# EAGLE schematic SAP-1 (EAGLE 9.5.1)
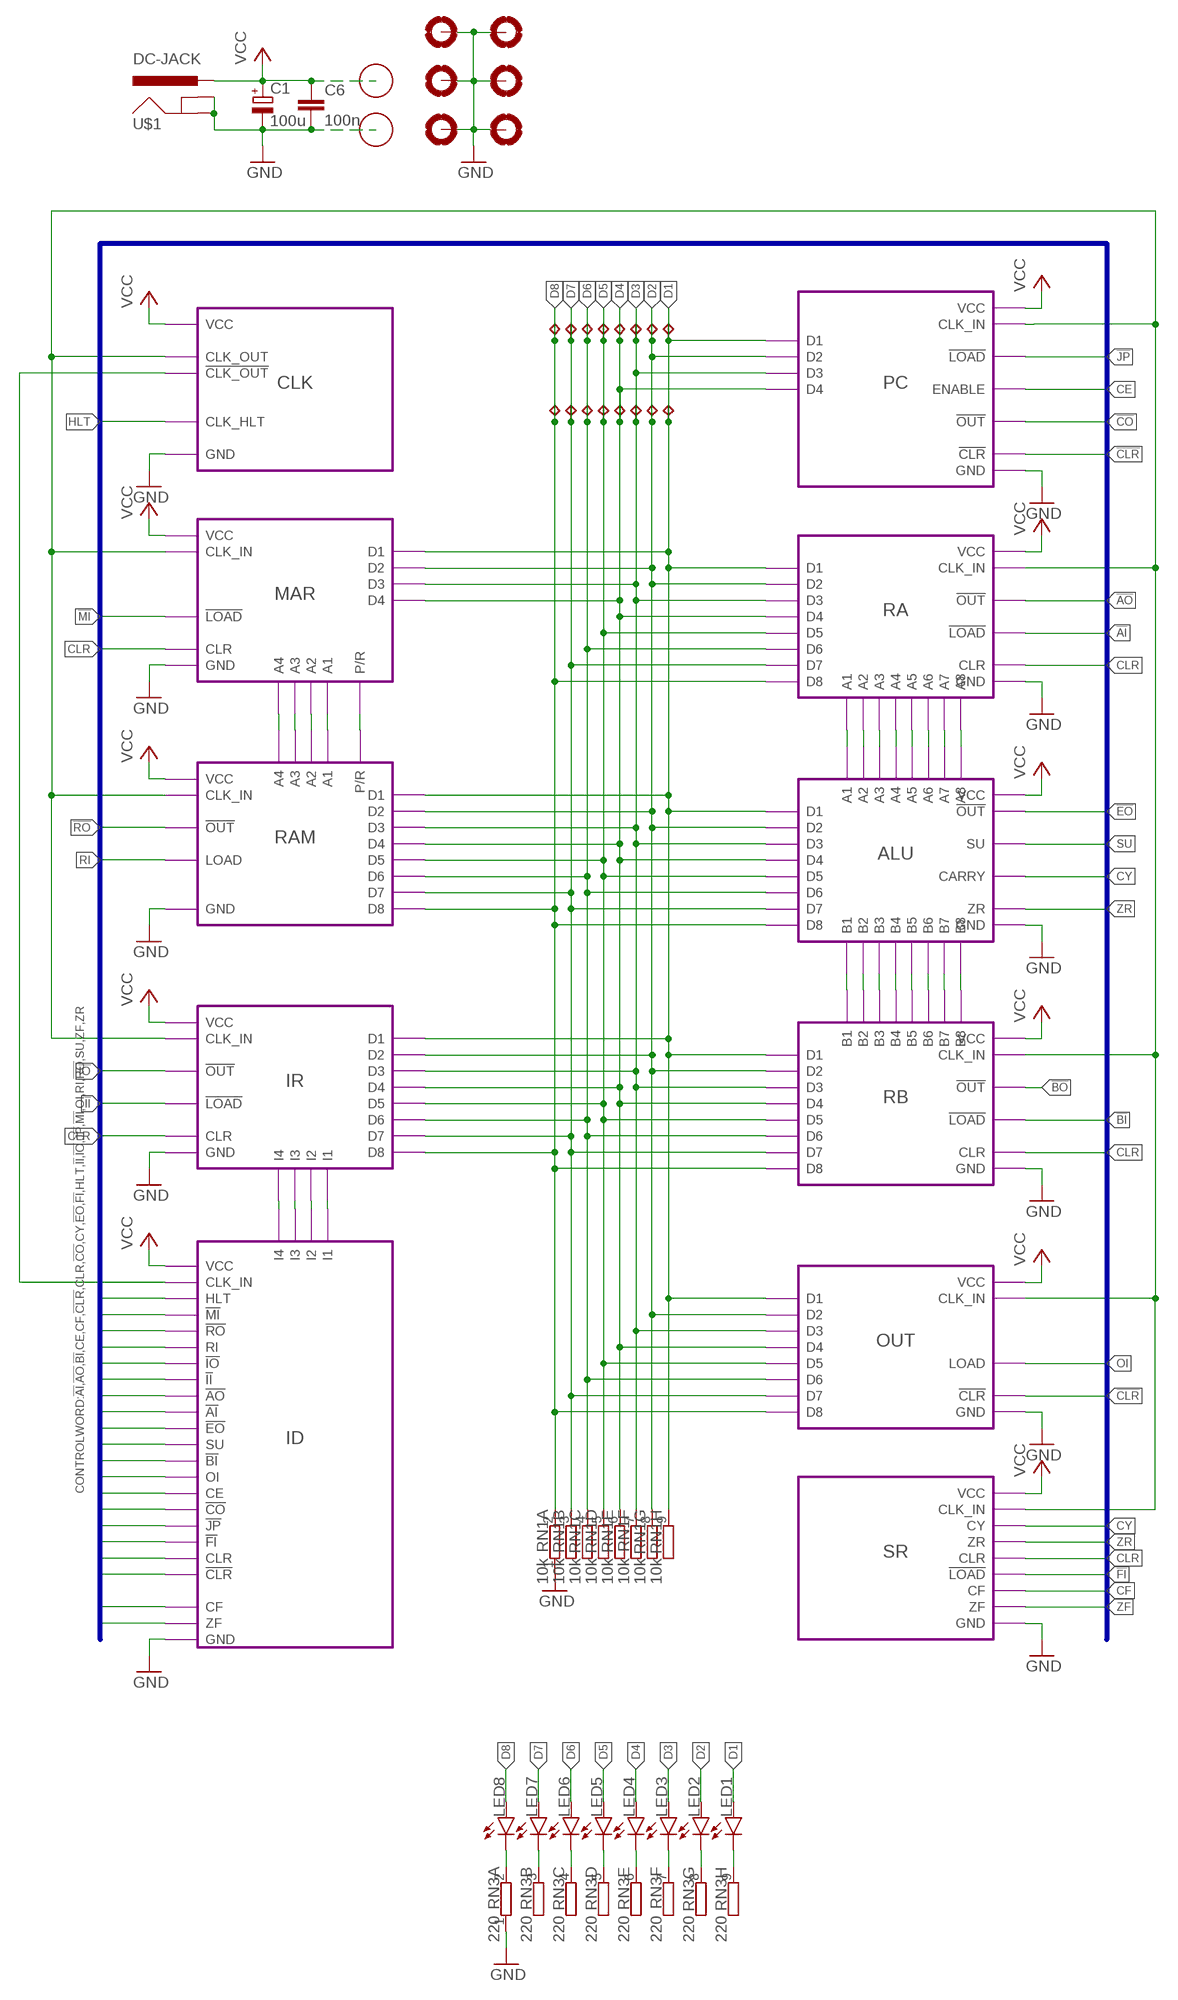
[diagram p0: schematic, sheet 1]

## Parts
C1  100u  CPOL-EUE3.5-8  [E3,5-8]
C6  100n  C-EU050-024X044  [C050-024X044]
H1  MOUNT-PAD-ROUND3.2  [3,2-PAD]
H2  MOUNT-PAD-ROUND3.2  [3,2-PAD]
H3  MOUNT-PAD-ROUND3.2  [3,2-PAD]
H4  MOUNT-PAD-ROUND3.2  [3,2-PAD]
H5  3.2  MOUNT-PAD-ROUND3.2  [3,2-PAD]
H6  3.2  MOUNT-PAD-ROUND3.2  [3,2-PAD]
J1  TERMINAL-1BRIDGE  [VOGT-1098A.68]
J2  TERMINAL-1BRIDGE  [VOGT-1098A.68]
LED1  RED  LED3MM  [LED3MM]
LED2  RED  LED3MM  [LED3MM]
LED3  RED  LED3MM  [LED3MM]
LED4  RED  LED3MM  [LED3MM]
LED5  RED  LED3MM  [LED3MM]
LED6  RED  LED3MM  [LED3MM]
LED7  RED  LED3MM  [LED3MM]
LED8  RED  LED3MM  [LED3MM]
RN1  10k  GE08R  [SIL9]
RN3  220  GE08R  [SIL9]
TP1  TPTP06R  [TP06R]
TP2  TPTP06R  [TP06R]
TP3  TPTP06R  [TP06R]
TP4  TPTP06R  [TP06R]
TP5  TPTP06R  [TP06R]
TP6  TPTP06R  [TP06R]
TP7  TPTP06R  [TP06R]
TP8  TPTP06R  [TP06R]
TP9  TPTP06R  [TP06R]
TP10  TPTP06R  [TP06R]
TP11  TPTP06R  [TP06R]
TP12  TPTP06R  [TP06R]
TP13  TPTP06R  [TP06R]
TP14  TPTP06R  [TP06R]
TP15  TPTP06R  [TP06R]
TP16  TPTP06R  [TP06R]
U$1  DC-JACK  [POWER_JACK_PTH]

## Module instances
CLK = CLOCK
RA = DATA_REGISTER_A
IR = INSTRUCTION_REGISTER
RB = DATA_REGISTER_B
ALU = ALU
MAR = MEMORY_ADDRESS_REGISTER
RAM = RAM
PC = PROGRAM_COUNTER
OUT = OUTPUT_DISPLAY
ID = INSTRUCTION_DECODER
SR = STATUS_REGISTER

## Nets
!AI: port RA.!LOAD ID.!AI
!AO: port RA.!OUT ID.!AO
!BI: port RB.!LOAD ID.!BI
!BO: port RB.!OUT
!CLK: port ID.CLK_IN CLK.!CLK_OUT
!CLR: port ID.!CLR OUT.!CLR PC.!CLR
!CO: port PC.!OUT ID.!CO
!EO: port ALU.!OUT ID.!EO
!FI: port SR.!LOAD ID.!FI
!II: port IR.!LOAD ID.!II
!IO: port IR.!OUT ID.!IO
!JP: port PC.!LOAD ID.!JP
!MI: port MAR.!LOAD ID.!MI
!RO: port RAM.!OUT ID.!RO
CE: port PC.ENABLE ID.CE
CF: port SR.CF ID.CF
CLK: port CLK.CLK_OUT MAR.CLK_IN RAM.CLK_IN IR.CLK_IN PC.CLK_IN RA.CLK_IN RB.CLK_IN OUT.CLK_IN SR.CLK_IN
CLR: port ID.CLR MAR.CLR IR.CLR RB.CLR RA.CLR SR.CLR
CY: port ALU.CARRY SR.CY
D1: LED1.A RN1.9 TP8.TP TP16.TP ; port RA.D1 MAR.D1 RAM.D1 IR.D1 ALU.D1 RB.D1 PC.D1 OUT.D1
D2: LED2.A RN1.8 TP7.TP TP15.TP ; port RA.D2 MAR.D2 RAM.D2 IR.D2 ALU.D2 RB.D2 PC.D2 OUT.D2
D3: LED3.A RN1.7 TP6.TP TP14.TP ; port RA.D3 MAR.D3 RAM.D3 IR.D3 ALU.D3 RB.D3 PC.D3 OUT.D3
D4: LED4.A RN1.6 TP5.TP TP13.TP ; port RA.D4 MAR.D4 RAM.D4 IR.D4 ALU.D4 RB.D4 PC.D4 OUT.D4
D5: LED5.A RN1.5 TP4.TP TP12.TP ; port RA.D5 RAM.D5 ALU.D5 RB.D5 OUT.D5 IR.D5
D6: LED6.A RN1.4 TP3.TP TP11.TP ; port RA.D6 RAM.D6 ALU.D6 RB.D6 OUT.D6 IR.D6
D7: LED7.A RN1.3 TP2.TP TP10.TP ; port RA.D7 RAM.D7 ALU.D7 RB.D7 OUT.D7 IR.D7
D8: LED8.A RN1.2 TP1.TP TP9.TP ; port RA.D8 RAM.D8 ALU.D8 RB.D8 OUT.D8 IR.D8
GND: C1.- C6.2 H1.B3,2(MOUNT) H2.B3,2(MOUNT) H3.B3,2(MOUNT) H4.B3,2(MOUNT) H5.B3,2(MOUNT) H6.B3,2(MOUNT) J2.P$1 J2.P$2 RN1.1 RN3.1 U$1.GND U$1.GNDBREAK ; port PC.GND RA.GND ALU.GND RB.GND OUT.GND SR.GND ID.GND IR.GND RAM.GND MAR.GND CLK.GND
HLT: port CLK.CLK_HLT ID.HLT
N$1: port RA.A8 ALU.A8
N$2: port RA.A7 ALU.A7
N$3: port RA.A6 ALU.A6
N$4: port RA.A5 ALU.A5
N$5: port RA.A4 ALU.A4
N$6: port RA.A3 ALU.A3
N$7: port RA.A2 ALU.A2
N$8: port RA.A1 ALU.A1
N$9: port RB.B1 ALU.B1
N$10: port RB.B2 ALU.B2
N$11: port RB.B3 ALU.B3
N$12: port RB.B4 ALU.B4
N$13: port RB.B5 ALU.B5
N$14: port RB.B6 ALU.B6
N$15: port RB.B7 ALU.B7
N$16: port RB.B8 ALU.B8
N$17: port RAM.A1 MAR.A1
N$18: port MAR.A2 RAM.A2
N$19: port RAM.A3 MAR.A3
N$20: port MAR.A4 RAM.A4
N$21: port RAM.P/R MAR.P/R
N$23: LED8.K(C) RN3.2
N$24: LED7.K(C) RN3.3
N$25: LED6.K(C) RN3.4
N$26: LED5.K(C) RN3.5
N$27: LED4.K(C) RN3.6
N$28: LED3.K(C) RN3.7
N$29: LED2.K(C) RN3.8
N$30: LED1.K(C) RN3.9
N$31: port ID.I1 IR.I1
N$33: port IR.I2 ID.I2
N$34: port ID.I3 IR.I3
N$35: port IR.I4 ID.I4
OI: port OUT.LOAD ID.OI
RI: port RAM.LOAD ID.RI
SU: port ALU.SU ID.SU
VCC: C1.+ C6.1 J1.P$1 J1.P$2 U$1.PWR ; port PC.VCC RA.VCC ALU.VCC RB.VCC OUT.VCC SR.VCC ID.VCC IR.VCC RAM.VCC MAR.VCC CLK.VCC
ZF: port SR.ZF ID.ZF
ZR: port ALU.ZR SR.ZR

## Buses
CONTROLWORD:!AI,!AO,!BI,CE,CF,!CLR,CLR,!CO,CY,!EO,!FI,HLT,!II,!IO,!JP,!MI,OI,RI,!RO,SU,ZF,ZR

## Library data of the parts
C1 = rcl:CPOL-EU: POLARIZED CAPACITOR, European symbol; MOUSER: 710-860040674004; SPICEPREFIX: C
C6 = rcl:C-EU: CAPACITOR, European symbol; MOUSER: 594-K104K15X7RF53H5; SPICEPREFIX: C
H1-H6 = holes:MOUNT-PAD-ROUND: MOUNTING PAD, round
J1 J2 = AdapterBoard:TERMINAL-1
LED1-LED8 = led:LED: LED OSRAM: - CHIPLED LG R971, LG N971, LY N971, LG Q971, LY Q971, LO R971, LY R971 LH N974, LH R974 LS Q976, LO Q976, LY Q976 LO Q996 - Hyper CHIPLED LW Q18S LB Q993, LB Q99A, LB R99A - SideLED LS A670, LO A670, LY A670, LG A670, LP A670 LB A673, LV A673, LT A673, LW A673 LH A674 LY A675 LS A676, LA A676, LO A676, LY A676, LW A676 LS A679, LY A679, LG A679 - Hyper Micro SIDELED® LS Y876, LA Y876, LO Y876, LY Y876 LT Y87S - SmartLED LW L88C, LW L88S LB L89C, LB L89S, LG L890 LS L89K, LO L89K, LY L89K LS L896, LA L896, LO L896, LY L896 - TOPLED LS T670, LO T670, LY T670, LG T670, LP T670 LSG T670, LSP T670, LSY T670, LOP T670, LYG T670 LG T671, LOG T671, LSG T671 LB T673, LV T673, LT T673, LW T673 LH T674 LS T676, LA T676, LO T676, LY T676, LB T676, LH T676, LSB T676, LW T676 LB T67C, LV T67C, LT T67C, LS T67K, LO T67K, LY T67K, LW E67C LS E67B, LA E67B, LO E67B, LY E67B, LB E67C, LV E67C, LT E67C LW T67C LS T679, LY T679, LG T679 LS T770, LO T770, LY T770, LG T770, LP T770 LB T773, LV T773, LT T773, LW T773 LH T774 LS E675, LA E675, LY E675, LS T675 LS T776, LA T776, LO T776, LY T776, LB T776 LHGB T686 LT T68C, LB T68C - Hyper Mini TOPLED® LB M676 - Mini TOPLED Santana® LG M470 LS M47K, LO M47K, LY M47K Source: http://www.osram.convergy.de LUXEON: - LUMILED® LXK2-PW12-R00, LXK2-PW12-S00, LXK2-PW14-U00, LXK2-PW14-V00 LXK2-PM12-R00, LXK2-PM12-S00, LXK2-PM14-U00 LXK2-PE12-Q00, LXK2-PE12-R00, LXK2-PE12-S00, LXK2-PE14-T00, LXK2-PE14-U00 LXK2-PB12-K00, LXK2-PB12-L00, LXK2-PB12-M00, LXK2-PB14-N00, LXK2-PB14-P00, LXK2-PB14-Q00 LXK2-PR12-L00, LXK2-PR12-M00, LXK2-PR14-Q00, LXK2-PR14-R00 LXK2-PD12-Q00, LXK2-PD12-R00, LXK2-PD12-S00 LXK2-PH12-R00, LXK2-PH12-S00 LXK2-PL12-P00, LXK2-PL12-Q00, LXK2-PL12-R00 Source: www.luxeon.com KINGBRIGHT: KA-3528ASYC Source: www.kingbright.com; MOUSER: 743-INL-3AR30
RN1 = resistor-sil:GE08R: SIL RESISTOR; MOUSER: 652-4609X-1LF-10K; OC_FARNELL: unknown; OC_NEWARK: unknown
RN3 = resistor-sil:GE08R: SIL RESISTOR; MOUSER: 652-4609X-1LF-220; OC_FARNELL: unknown; OC_NEWARK: unknown
TP1-TP16 = testpad:TP: Test pad
U$1 = Parts:DC-JACK

## Module CLOCK
Ports: CLK_OUT(out) CLK_HLT(in) !CLK_OUT(out) VCC(pwr) GND(pwr)
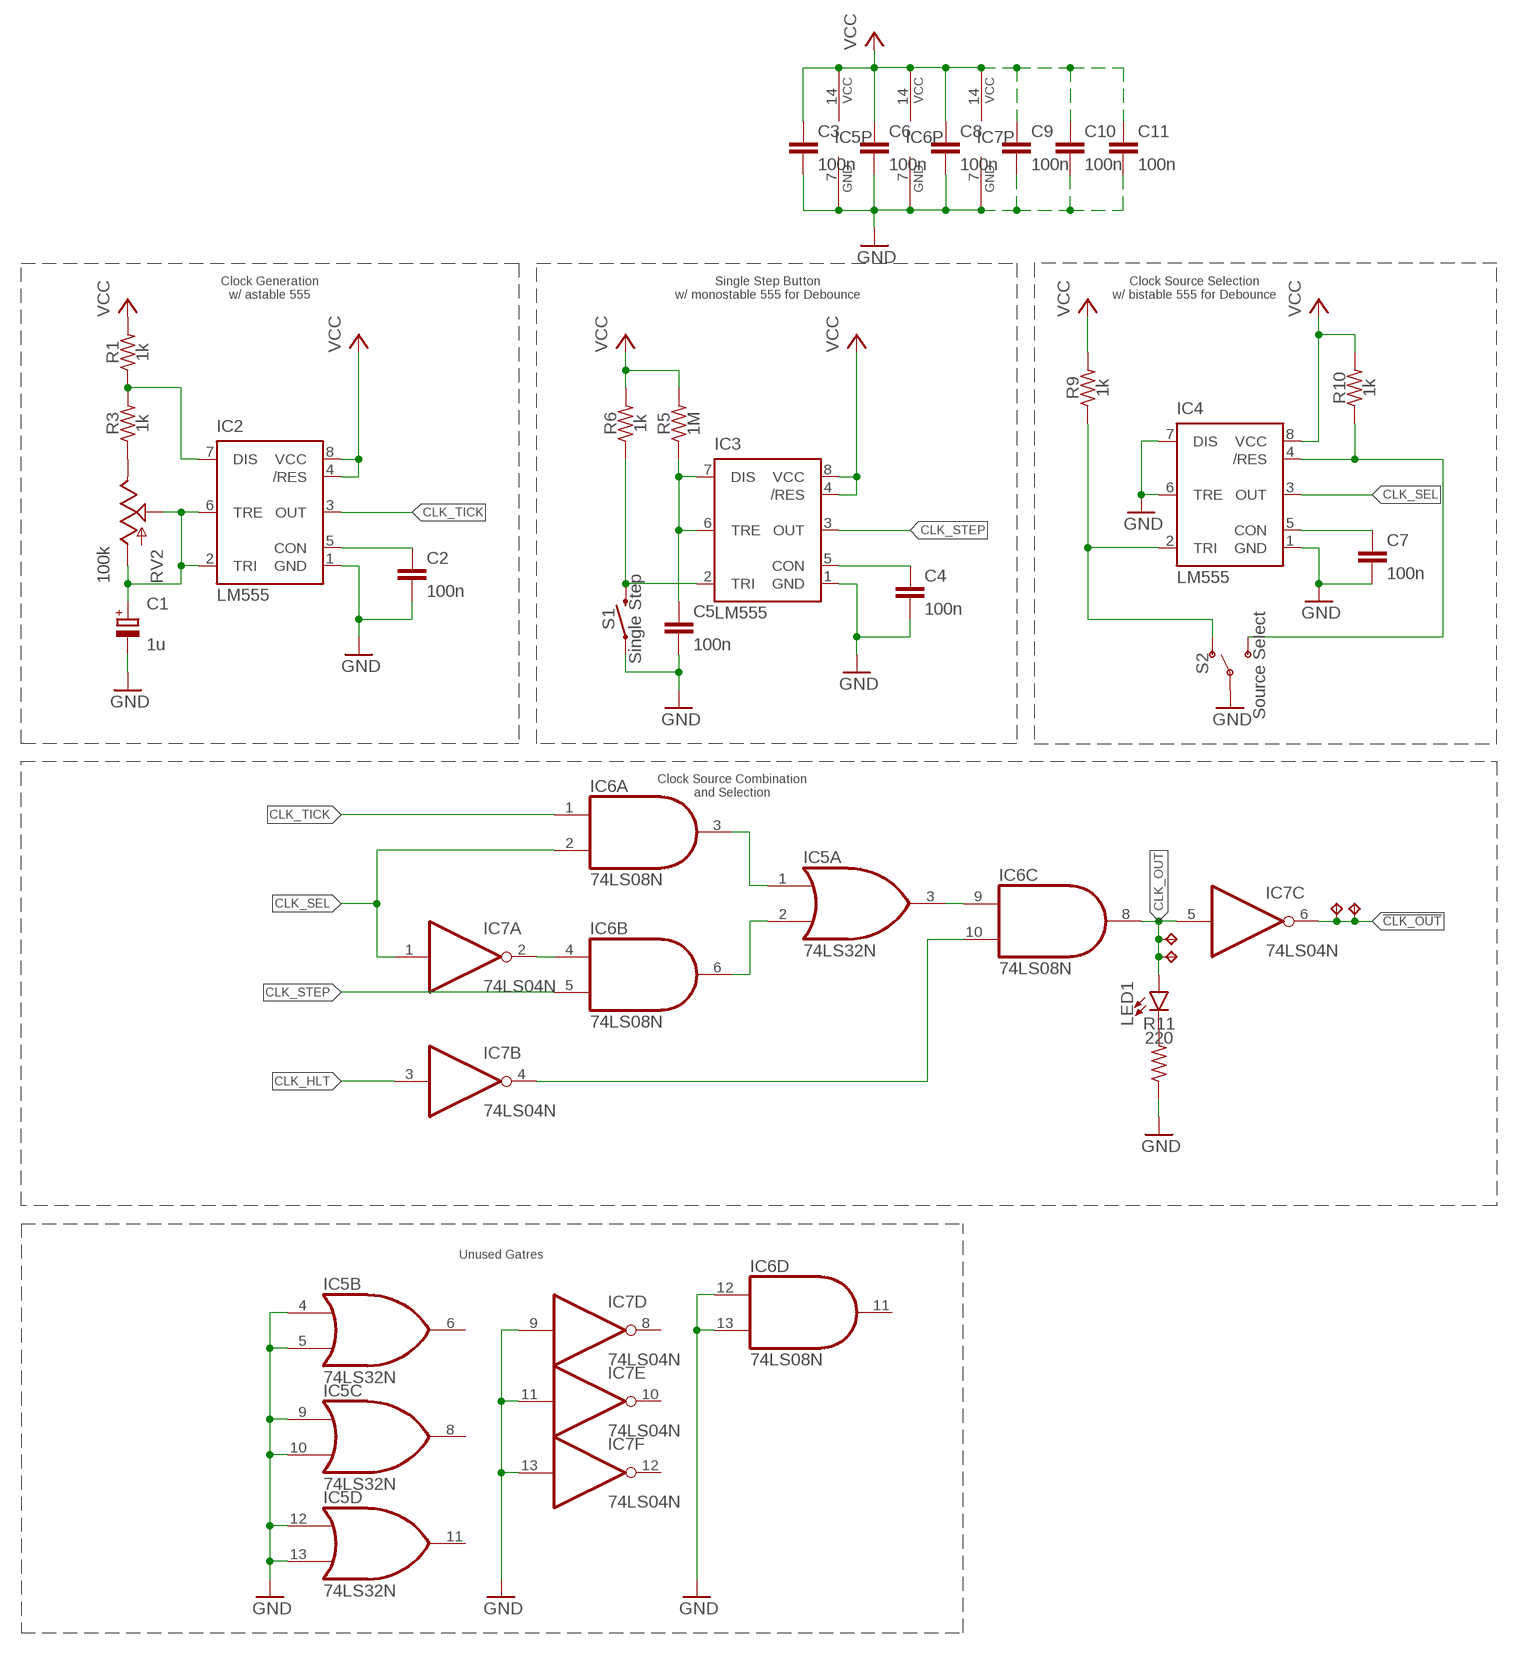
[diagram p1: schematic, module CLOCK, sheet 1]

### Parts
C1  1u  CPOL-EUE2.5-7  [E2,5-7]
C2  100n  C-EU050-024X044  [C050-024X044]
C3  100n  C-EU050-024X044  [C050-024X044]
C4  100n  C-EU050-024X044  [C050-024X044]
C5  100n  C-EU050-024X044  [C050-024X044]
C6  100n  C-EU050-024X044  [C050-024X044]
C7  100n  C-EU050-024X044  [C050-024X044]
C8  100n  C-EU050-024X044  [C050-024X044]
C9  100n  C-EU050-024X044  [C050-024X044]
C10  100n  C-EU050-024X044  [C050-024X044]
C11  100n  C-EU050-024X044  [C050-024X044]
IC2  LM555  [DIP8]
IC3  LM555  [DIP8]
IC4  LM555  [DIP8]
IC5  74LS32N  [DIL14]
IC6  74LS08N  74ALS08N  [DIL14]
IC7  74LS04N  74LS06N  [DIL14]
LED1  RED  LED3MM  [LED3MM]
R1  1k  R-US_0204/7  [0204/7]
R3  1k  R-US_0204/7  [0204/7]
R5  1M  R-US_0204/7  [0204/7]
R6  1k  R-US_0204/7  [0204/7]
R9  1k  R-US_0204/7  [0204/7]
R10  1k  R-US_0204/7  [0204/7]
R11  220  R-US_0204/7  [0204/7]
RV2  100k  POTALPS-KIT  [ALPS_POT_KIT]
S1  Single Step  MOMENTARY-SWITCH-SPST-PTH-12MM  [TACTILE_SWITCH_PTH_12MM]
S2  Source Select  SWITCH-SPDT-PTH-11.6X4.0MM-KIT  [SWITCH_SPDT_PTH_11.6X4.0MM_KIT]
TP1  TPTP06R  [TP06R]
TP2  TPTP06R  [TP06R]
TP3  TPTP06R  [TP06R]
TP4  TPTP06R  [TP06R]

### Nets
!CLK_OUT: IC7.6(C:O) TP1.TP TP4.TP
CLK_HLT: IC7.3(B:I)
CLK_OUT: IC6.8(C:O) IC7.5(C:I) LED1.A TP2.TP TP3.TP
CLK_SEL: IC4.3(OUT) IC6.2(A:I1) IC7.1(A:I)
CLK_STEP: IC3.3(OUT) IC6.5(B:I1)
CLK_TICK: IC2.3(OUT) IC6.1(A:I0)
GND: C1.- C2.2 C3.2 C4.2 C5.2 C6.2 C7.2 C8.2 C9.2 C10.2 C11.2 IC2.1(GND) IC3.1(GND) IC4.1(GND) IC4.6(TRE) IC4.7(DIS) IC5.4(B:I0) IC5.5(B:I1) IC5.7(P:GND) IC5.9(C:I0) IC5.10(C:I1) IC5.12(D:I0) IC5.13(D:I1) IC6.7(P:GND) IC6.12(D:I0) IC6.13(D:I1) IC7.7(P:GND) IC7.9(D:I) IC7.11(E:I) IC7.13(F:I) R11.1 S1.1 S2.2(P)
N$1: C1.+ IC2.2(TRI) IC2.6(TRE) RV2.P$2(S) RV2.P$3(A)
N$2: IC2.7(DIS) R1.1 R3.2
N$3: R3.1 RV2.P$1(E)
N$4: LED1.K(C) R11.2
N$6: C2.1 IC2.5(CON)
N$7: IC3.2(TRI) R6.1 S1.3
N$8: C4.1 IC3.5(CON)
N$11: C5.1 IC3.6(TRE) IC3.7(DIS) R5.1
N$12: C7.1 IC4.5(CON)
N$13: IC6.4(B:I0) IC7.2(A:O)
N$14: IC5.1(A:I0) IC6.3(A:O)
N$15: IC4.2(TRI) R9.1 S2.1(O)
N$16: IC4.4(/RES) R10.1 S2.3(S)
N$17: IC5.2(A:I1) IC6.6(B:O)
N$18: IC5.3(A:O) IC6.9(C:I0)
N$19: IC6.10(C:I1) IC7.4(B:O)
VCC: C3.1 C6.1 C8.1 C9.1 C10.1 C11.1 IC2.4(/RES) IC2.8(VCC) IC3.4(/RES) IC3.8(VCC) IC4.8(VCC) IC5.14(P:VCC) IC6.14(P:VCC) IC7.14(P:VCC) R1.2 R5.2 R6.2 R9.2 R10.2
Unconnected: IC5.6(B:O) IC5.8(C:O) IC5.11(D:O) IC6.11(D:O) IC7.8(D:O) IC7.10(E:O) IC7.12(F:O)

### Notes on the sheet
- Clock Generation
  w/ astable 555
- Single Step Button
  w/ monostable 555 for Debounce
- Clock Source Selection
  w/ bistable 555 for Debounce
- Clock Source Combination
  and Selection
- Unused Gatres

### Library data of the parts
C1 = rcl:CPOL-EU: POLARIZED CAPACITOR, European symbol; MOUSER: 710-860021373002; SPICEPREFIX: C
C2-C11 = rcl:C-EU: CAPACITOR, European symbol; MOUSER: 594-K104K15X7RF53H5; SPICEPREFIX: C
IC2-IC4 = SAP-1:LM555; MOUSER: 926-LM555CN/NOPB
IC5 = 74xx-us:74*32: Quad 2-input OR gate; MOUSER: 595-SN74LS32N
IC6 = 74xx-us:74*08: Quad 2-input AND gate; MOUSER: 595-SN74LS08N
IC7 = 74xx-us:74*06: Hex INVERTER, open collector high-voltage output; MOUSER: 595-SN74LS04N
LED1 = led:LED: LED OSRAM: - CHIPLED LG R971, LG N971, LY N971, LG Q971, LY Q971, LO R971, LY R971 LH N974, LH R974 LS Q976, LO Q976, LY Q976 LO Q996 - Hyper CHIPLED LW Q18S LB Q993, LB Q99A, LB R99A - SideLED LS A670, LO A670, LY A670, LG A670, LP A670 LB A673, LV A673, LT A673, LW A673 LH A674 LY A675 LS A676, LA A676, LO A676, LY A676, LW A676 LS A679, LY A679, LG A679 - Hyper Micro SIDELED® LS Y876, LA Y876, LO Y876, LY Y876 LT Y87S - SmartLED LW L88C, LW L88S LB L89C, LB L89S, LG L890 LS L89K, LO L89K, LY L89K LS L896, LA L896, LO L896, LY L896 - TOPLED LS T670, LO T670, LY T670, LG T670, LP T670 LSG T670, LSP T670, LSY T670, LOP T670, LYG T670 LG T671, LOG T671, LSG T671 LB T673, LV T673, LT T673, LW T673 LH T674 LS T676, LA T676, LO T676, LY T676, LB T676, LH T676, LSB T676, LW T676 LB T67C, LV T67C, LT T67C, LS T67K, LO T67K, LY T67K, LW E67C LS E67B, LA E67B, LO E67B, LY E67B, LB E67C, LV E67C, LT E67C LW T67C LS T679, LY T679, LG T679 LS T770, LO T770, LY T770, LG T770, LP T770 LB T773, LV T773, LT T773, LW T773 LH T774 LS E675, LA E675, LY E675, LS T675 LS T776, LA T776, LO T776, LY T776, LB T776 LHGB T686 LT T68C, LB T68C - Hyper Mini TOPLED® LB M676 - Mini TOPLED Santana® LG M470 LS M47K, LO M47K, LY M47K Source: http://www.osram.convergy.de LUXEON: - LUMILED® LXK2-PW12-R00, LXK2-PW12-S00, LXK2-PW14-U00, LXK2-PW14-V00 LXK2-PM12-R00, LXK2-PM12-S00, LXK2-PM14-U00 LXK2-PE12-Q00, LXK2-PE12-R00, LXK2-PE12-S00, LXK2-PE14-T00, LXK2-PE14-U00 LXK2-PB12-K00, LXK2-PB12-L00, LXK2-PB12-M00, LXK2-PB14-N00, LXK2-PB14-P00, LXK2-PB14-Q00 LXK2-PR12-L00, LXK2-PR12-M00, LXK2-PR14-Q00, LXK2-PR14-R00 LXK2-PD12-Q00, LXK2-PD12-R00, LXK2-PD12-S00 LXK2-PH12-R00, LXK2-PH12-S00 LXK2-PL12-P00, LXK2-PL12-Q00, LXK2-PL12-R00 Source: www.luxeon.com KINGBRIGHT: KA-3528ASYC Source: www.kingbright.com; MOUSER: 743-INL-3AR30
R1 R3 R6 R9 R10 = rcl:R-US_: RESISTOR, American symbol; MOUSER: 594-5063JD1K000F; SPICEPREFIX: R
R5 = rcl:R-US_: RESISTOR, American symbol; MOUSER: 594-5063JD1M000F; SPICEPREFIX: R
R11 = rcl:R-US_: RESISTOR, American symbol; MOUSER: 594-5063JD220R0F; SPICEPREFIX: R
RV2 = SparkFun-Electromechanical:POT; MOUSER: PTV09A-4020F-B105; PROD_ID: RES-09177
S1 = SparkFun-Switches:MOMENTARY-SWITCH-SPST: Momentary Switch (Pushbutton) - SPST Normally-open (NO) SPST momentary switches (buttons, pushbuttons). Variants PTH-12MM - 12mm square, through-hole Momentary Pushbutton Switch - 12mm Square <https://www.sparkfun.com/products/9190> (COM-09190) PTH-6.0MM, PTH-6.0MM-KIT - 6.0mm square, through-hole Mini Pushbutton Switch <https://www.sparkfun.com/products/97> (COM-00097) KIT package intended for soldering kit's - only one side of pads' copper is exposed. PTH-RIGHT-ANGLE-KIT - Right-angle, through-hole Right Angle Tactile Button <https://www.sparkfun.com/products/10791> - Used on SparkFun BigTime Watch Kit <https://www.sparkfun.com/products/11734> SMD-12MM - 12mm square, surface-mount Tactile Button - SMD (12mm) <https://www.sparkfun.com/products/12993> (COM-12993) Used on SparkFun PicoBoard <https://www.sparkfun.com/products/11888> SMD-4.5MM - 4.5mm Square Trackball Switch Used on SparkFun Blackberry Trackballer Breakout <https://www.sparkfun.com/products/13169> SMD-4.6MMX2.8MM - 4.60mm x 2.80mm, surface mount Used on SparkFun SAMD21 Mini Breakout <https://www.sparkfun.com/products/13664> SMD-5.2MM, SMD-5.2-REDUNDANT - 5.2mm square, surface-mount Mini Pushbutton Switch - SMD <https://www.sparkfun.com/products/8720> (COM-08720) Used on Arduino Pro Mini <https://www.sparkfun.com/products/11114> REDUNDANT package connects both switch circuits together SMD-6.0X3.5MM - 6.0 x 3.5mm, surface mount Momentary Reset Switch SMD <https://www.sparkfun.com/products/8229> (COM-08229) SMD-6.2MM-TALL - 6.2mm square, surface mount Tactile Button - SMD (6mm) <https://www.sparkfun.com/products/12992> Used on SparkFun Digital Sandbox <https://www.sparkfun.com/products/12651> SMD-RIGHT-ANGLE - Right-angle, surface mount Used on SparkFun Block for Intel® Edison - Arduino <https://www.sparkfun.com/products/13036>; MOUSER: 474-COM-09190; PROD_ID: SWCH-09185; SF_SKU: COM-09190
S2 = SparkFun-Switches:SWITCH-SPDT: Single Pole, Double Throw (SPDT) Switch Single-pole, double-throw (SPDT) switch. Variant Overview SMD-AYZ0202 Surface Mount DPDT Switch <https://www.sparkfun.com/products/597> (COM-00597) Used on e.g. LilyPad Arduino USB - ATmega32U4 Board <https://www.sparkfun.com/products/12049> PTH-11.6X4.0MM SPDT Mini Power Switch <https://www.sparkfun.com/products/102> (COM-00102) Used on e.g. SparkFun Simon Says - Through-Hole Soldering Kit <https://www.sparkfun.com/products/10547> (KIT-10547) PTH-11.6X4.0MM-KIT KIT version of SPDT Mini Power Switch - Simplifies soldering by removing tStop of switch pins - only one side can be soldered. PTH-11.6X4.0MM-LOCK LOCK version of SPDT Mini Power Switch - Offset pins hold switch in place for easier soldering. SMD-RIGHT-ANGLE Surface Mount Right Angle Switch <https://www.sparkfun.com/products/10860> (COM-10860) Used on e.g. SparkFun ESP8266 Thing <https://www.sparkfun.com/products/13231>; MOUSER: 474-COM-00102; MOUSER_CHEAP: 474-COM-09609; PROD_ID: SWCH-08261; SF_SKU: COM-00102
TP1-TP4 = testpad:TP: Test pad

## Module DATA_REGISTER_A
Ports: !OUT(in) !LOAD(in) CLK_IN(in) CLR(in) D1(io) D2(io) D3(io) D4(io) D5(io) D6(io) D7(io) D8(io) A1(out) A2(out) A3(out) A4(out) A5(out) A6(out) A7(out) A8(out) GND(pwr) VCC(pwr)
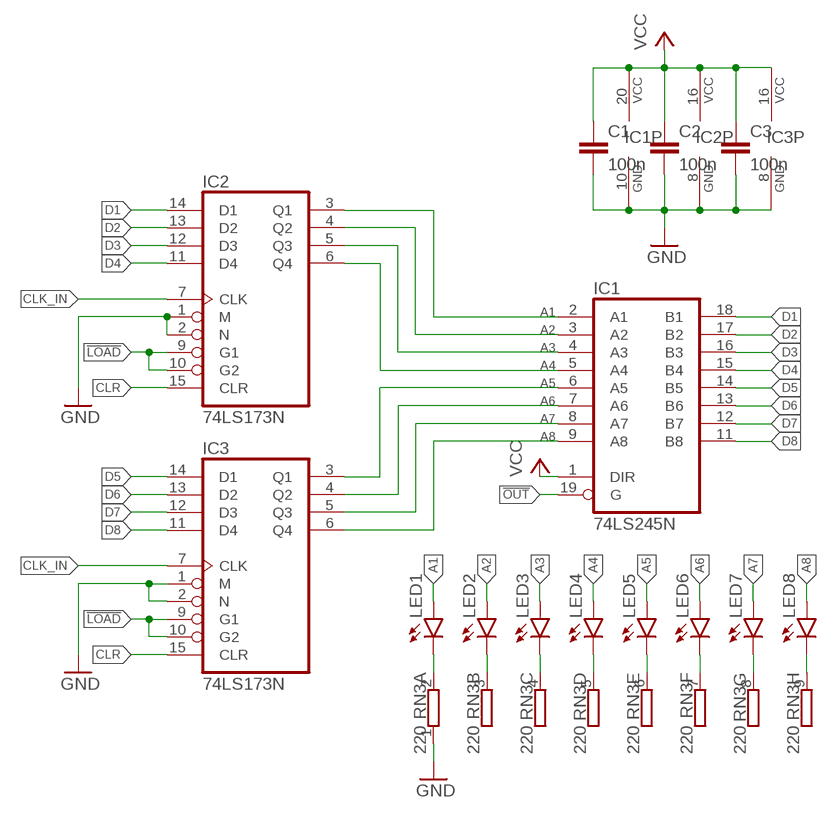
[diagram p2: schematic, module DATA_REGISTER_A, sheet 1]

### Parts
C1  100n  C-EU050-024X044  [C050-024X044]
C2  100n  C-EU050-024X044  [C050-024X044]
C3  100n  C-EU050-024X044  [C050-024X044]
IC1  74LS245N  [DIL20]
IC2  74LS173N  [DIL16]
IC3  74LS173N  [DIL16]
LED1  RED  LED3MM  [LED3MM]
LED2  RED  LED3MM  [LED3MM]
LED3  RED  LED3MM  [LED3MM]
LED4  RED  LED3MM  [LED3MM]
LED5  RED  LED3MM  [LED3MM]
LED6  RED  LED3MM  [LED3MM]
LED7  RED  LED3MM  [LED3MM]
LED8  RED  LED3MM  [LED3MM]
RN3  220  GE08R  [SIL9]

### Nets
!LOAD: IC2.9(G1) IC2.10(G2) IC3.9(G1) IC3.10(G2)
!OUT: IC1.19(G)
A1: IC1.2(A1) IC2.3(Q1) LED1.A
A2: IC1.3(A2) IC2.4(Q2) LED2.A
A3: IC1.4(A3) IC2.5(Q3) LED3.A
A4: IC1.5(A4) IC2.6(Q4) LED4.A
A5: IC1.6(A5) IC3.3(Q1) LED5.A
A6: IC1.7(A6) IC3.4(Q2) LED6.A
A7: IC1.8(A7) IC3.5(Q3) LED7.A
A8: IC1.9(A8) IC3.6(Q4) LED8.A
CLK_IN: IC2.7(CLK) IC3.7(CLK)
CLR: IC2.15(CLR) IC3.15(CLR)
D1: IC1.18(B1) IC2.14(D1)
D2: IC1.17(B2) IC2.13(D2)
D3: IC1.16(B3) IC2.12(D3)
D4: IC1.15(B4) IC2.11(D4)
D5: IC1.14(B5) IC3.14(D1)
D6: IC1.13(B6) IC3.13(D2)
D7: IC1.12(B7) IC3.12(D3)
D8: IC1.11(B8) IC3.11(D4)
GND: C1.2 C2.2 C3.2 IC1.10(GND) IC2.1(M) IC2.2(N) IC2.8(GND) IC3.1(M) IC3.2(N) IC3.8(GND) RN3.1
N$1: LED1.K(C) RN3.2
N$2: LED2.K(C) RN3.3
N$3: LED3.K(C) RN3.4
N$4: LED4.K(C) RN3.5
N$5: LED5.K(C) RN3.6
N$6: LED6.K(C) RN3.7
N$7: LED7.K(C) RN3.8
N$8: LED8.K(C) RN3.9
VCC: C1.1 C2.1 C3.1 IC1.1(DIR) IC1.20(VCC) IC2.16(VCC) IC3.16(VCC)

### Library data of the parts
C1-C3 = rcl:C-EU: CAPACITOR, European symbol; MOUSER: 594-K104K15X7RF53H5; SPICEPREFIX: C
IC1 = 74xx-us:74*245: Octal BUS TRANSCEIVER, 3-state; MOUSER: 595-SN74LS245N
IC2 IC3 = 74xx-us:74*173: 4-bit D type REGISTER, 3-state; MOUSER: SN74LS173AN
LED1-LED8 = led:LED: LED OSRAM: - CHIPLED LG R971, LG N971, LY N971, LG Q971, LY Q971, LO R971, LY R971 LH N974, LH R974 LS Q976, LO Q976, LY Q976 LO Q996 - Hyper CHIPLED LW Q18S LB Q993, LB Q99A, LB R99A - SideLED LS A670, LO A670, LY A670, LG A670, LP A670 LB A673, LV A673, LT A673, LW A673 LH A674 LY A675 LS A676, LA A676, LO A676, LY A676, LW A676 LS A679, LY A679, LG A679 - Hyper Micro SIDELED® LS Y876, LA Y876, LO Y876, LY Y876 LT Y87S - SmartLED LW L88C, LW L88S LB L89C, LB L89S, LG L890 LS L89K, LO L89K, LY L89K LS L896, LA L896, LO L896, LY L896 - TOPLED LS T670, LO T670, LY T670, LG T670, LP T670 LSG T670, LSP T670, LSY T670, LOP T670, LYG T670 LG T671, LOG T671, LSG T671 LB T673, LV T673, LT T673, LW T673 LH T674 LS T676, LA T676, LO T676, LY T676, LB T676, LH T676, LSB T676, LW T676 LB T67C, LV T67C, LT T67C, LS T67K, LO T67K, LY T67K, LW E67C LS E67B, LA E67B, LO E67B, LY E67B, LB E67C, LV E67C, LT E67C LW T67C LS T679, LY T679, LG T679 LS T770, LO T770, LY T770, LG T770, LP T770 LB T773, LV T773, LT T773, LW T773 LH T774 LS E675, LA E675, LY E675, LS T675 LS T776, LA T776, LO T776, LY T776, LB T776 LHGB T686 LT T68C, LB T68C - Hyper Mini TOPLED® LB M676 - Mini TOPLED Santana® LG M470 LS M47K, LO M47K, LY M47K Source: http://www.osram.convergy.de LUXEON: - LUMILED® LXK2-PW12-R00, LXK2-PW12-S00, LXK2-PW14-U00, LXK2-PW14-V00 LXK2-PM12-R00, LXK2-PM12-S00, LXK2-PM14-U00 LXK2-PE12-Q00, LXK2-PE12-R00, LXK2-PE12-S00, LXK2-PE14-T00, LXK2-PE14-U00 LXK2-PB12-K00, LXK2-PB12-L00, LXK2-PB12-M00, LXK2-PB14-N00, LXK2-PB14-P00, LXK2-PB14-Q00 LXK2-PR12-L00, LXK2-PR12-M00, LXK2-PR14-Q00, LXK2-PR14-R00 LXK2-PD12-Q00, LXK2-PD12-R00, LXK2-PD12-S00 LXK2-PH12-R00, LXK2-PH12-S00 LXK2-PL12-P00, LXK2-PL12-Q00, LXK2-PL12-R00 Source: www.luxeon.com KINGBRIGHT: KA-3528ASYC Source: www.kingbright.com; MOUSER: 743-INL-3AR30
RN3 = resistor-sil:GE08R: SIL RESISTOR; MOUSER: 652-4609X-1LF-220; OC_FARNELL: unknown; OC_NEWARK: unknown

## Module INSTRUCTION_REGISTER
Ports: CLK_IN(in) !OUT(in) !LOAD(in) CLR(in) D1(io) D2(io) D3(io) D4(io) I1(io) I2(io) I3(io) I4(io) D5(io) D6(io) D7(io) D8(io) VCC(pwr) GND(pwr)
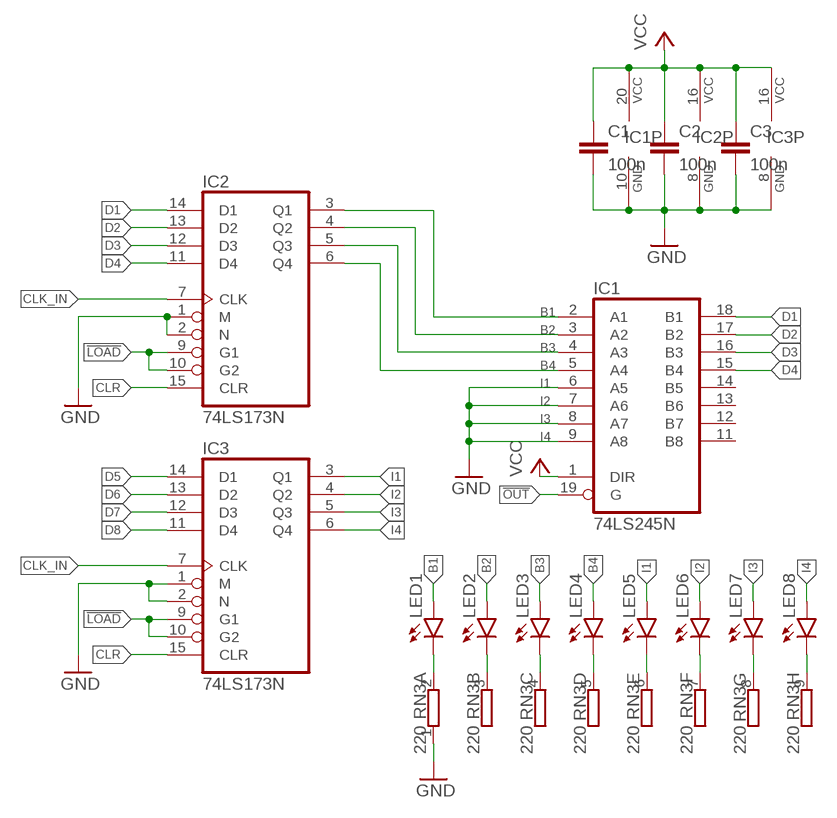
[diagram p3: schematic, module INSTRUCTION_REGISTER, sheet 1]

### Parts
C1  100n  C-EU050-024X044  [C050-024X044]
C2  100n  C-EU050-024X044  [C050-024X044]
C3  100n  C-EU050-024X044  [C050-024X044]
IC1  74LS245N  [DIL20]
IC2  74LS173N  [DIL16]
IC3  74LS173N  [DIL16]
LED1  RED  LED3MM  [LED3MM]
LED2  RED  LED3MM  [LED3MM]
LED3  RED  LED3MM  [LED3MM]
LED4  RED  LED3MM  [LED3MM]
LED5  BLUE  LED3MM  [LED3MM]
LED6  BLUE  LED3MM  [LED3MM]
LED7  BLUE  LED3MM  [LED3MM]
LED8  BLUE  LED3MM  [LED3MM]
RN3  220  GE08R  [SIL9]

### Nets
!LOAD: IC2.9(G1) IC2.10(G2) IC3.9(G1) IC3.10(G2)
!OUT: IC1.19(G)
B1: IC1.2(A1) IC2.3(Q1) LED1.A
B2: IC1.3(A2) IC2.4(Q2) LED2.A
B3: IC1.4(A3) IC2.5(Q3) LED3.A
B4: IC1.5(A4) IC2.6(Q4) LED4.A
CLK_IN: IC2.7(CLK) IC3.7(CLK)
CLR: IC2.15(CLR) IC3.15(CLR)
D1: IC1.18(B1) IC2.14(D1)
D2: IC1.17(B2) IC2.13(D2)
D3: IC1.16(B3) IC2.12(D3)
D4: IC1.15(B4) IC2.11(D4)
D5: IC3.14(D1)
D6: IC3.13(D2)
D7: IC3.12(D3)
D8: IC3.11(D4)
GND: C1.2 C2.2 C3.2 IC1.6(A5) IC1.7(A6) IC1.8(A7) IC1.9(A8) IC1.10(GND) IC2.1(M) IC2.2(N) IC2.8(GND) IC3.1(M) IC3.2(N) IC3.8(GND) RN3.1
I1: IC3.3(Q1) LED5.A
I2: IC3.4(Q2) LED6.A
I3: IC3.5(Q3) LED7.A
I4: IC3.6(Q4) LED8.A
N$1: LED8.K(C) RN3.9
N$2: LED7.K(C) RN3.8
N$3: LED6.K(C) RN3.7
N$5: LED5.K(C) RN3.6
N$6: LED4.K(C) RN3.5
N$7: LED3.K(C) RN3.4
N$8: LED2.K(C) RN3.3
N$9: LED1.K(C) RN3.2
VCC: C1.1 C2.1 C3.1 IC1.1(DIR) IC1.20(VCC) IC2.16(VCC) IC3.16(VCC)
Unconnected: IC1.11(B8) IC1.12(B7) IC1.13(B6) IC1.14(B5)

### Library data of the parts
C1-C3 = rcl:C-EU: CAPACITOR, European symbol; MOUSER: 594-K104K15X7RF53H5; SPICEPREFIX: C
IC1 = 74xx-us:74*245: Octal BUS TRANSCEIVER, 3-state; MOUSER: 595-SN74LS245N
IC2 IC3 = 74xx-us:74*173: 4-bit D type REGISTER, 3-state; MOUSER: SN74LS173AN
LED1-LED4 = led:LED: LED OSRAM: - CHIPLED LG R971, LG N971, LY N971, LG Q971, LY Q971, LO R971, LY R971 LH N974, LH R974 LS Q976, LO Q976, LY Q976 LO Q996 - Hyper CHIPLED LW Q18S LB Q993, LB Q99A, LB R99A - SideLED LS A670, LO A670, LY A670, LG A670, LP A670 LB A673, LV A673, LT A673, LW A673 LH A674 LY A675 LS A676, LA A676, LO A676, LY A676, LW A676 LS A679, LY A679, LG A679 - Hyper Micro SIDELED® LS Y876, LA Y876, LO Y876, LY Y876 LT Y87S - SmartLED LW L88C, LW L88S LB L89C, LB L89S, LG L890 LS L89K, LO L89K, LY L89K LS L896, LA L896, LO L896, LY L896 - TOPLED LS T670, LO T670, LY T670, LG T670, LP T670 LSG T670, LSP T670, LSY T670, LOP T670, LYG T670 LG T671, LOG T671, LSG T671 LB T673, LV T673, LT T673, LW T673 LH T674 LS T676, LA T676, LO T676, LY T676, LB T676, LH T676, LSB T676, LW T676 LB T67C, LV T67C, LT T67C, LS T67K, LO T67K, LY T67K, LW E67C LS E67B, LA E67B, LO E67B, LY E67B, LB E67C, LV E67C, LT E67C LW T67C LS T679, LY T679, LG T679 LS T770, LO T770, LY T770, LG T770, LP T770 LB T773, LV T773, LT T773, LW T773 LH T774 LS E675, LA E675, LY E675, LS T675 LS T776, LA T776, LO T776, LY T776, LB T776 LHGB T686 LT T68C, LB T68C - Hyper Mini TOPLED® LB M676 - Mini TOPLED Santana® LG M470 LS M47K, LO M47K, LY M47K Source: http://www.osram.convergy.de LUXEON: - LUMILED® LXK2-PW12-R00, LXK2-PW12-S00, LXK2-PW14-U00, LXK2-PW14-V00 LXK2-PM12-R00, LXK2-PM12-S00, LXK2-PM14-U00 LXK2-PE12-Q00, LXK2-PE12-R00, LXK2-PE12-S00, LXK2-PE14-T00, LXK2-PE14-U00 LXK2-PB12-K00, LXK2-PB12-L00, LXK2-PB12-M00, LXK2-PB14-N00, LXK2-PB14-P00, LXK2-PB14-Q00 LXK2-PR12-L00, LXK2-PR12-M00, LXK2-PR14-Q00, LXK2-PR14-R00 LXK2-PD12-Q00, LXK2-PD12-R00, LXK2-PD12-S00 LXK2-PH12-R00, LXK2-PH12-S00 LXK2-PL12-P00, LXK2-PL12-Q00, LXK2-PL12-R00 Source: www.luxeon.com KINGBRIGHT: KA-3528ASYC Source: www.kingbright.com; MOUSER: 743-INL-3AR30
LED5-LED8 = led:LED: LED OSRAM: - CHIPLED LG R971, LG N971, LY N971, LG Q971, LY Q971, LO R971, LY R971 LH N974, LH R974 LS Q976, LO Q976, LY Q976 LO Q996 - Hyper CHIPLED LW Q18S LB Q993, LB Q99A, LB R99A - SideLED LS A670, LO A670, LY A670, LG A670, LP A670 LB A673, LV A673, LT A673, LW A673 LH A674 LY A675 LS A676, LA A676, LO A676, LY A676, LW A676 LS A679, LY A679, LG A679 - Hyper Micro SIDELED® LS Y876, LA Y876, LO Y876, LY Y876 LT Y87S - SmartLED LW L88C, LW L88S LB L89C, LB L89S, LG L890 LS L89K, LO L89K, LY L89K LS L896, LA L896, LO L896, LY L896 - TOPLED LS T670, LO T670, LY T670, LG T670, LP T670 LSG T670, LSP T670, LSY T670, LOP T670, LYG T670 LG T671, LOG T671, LSG T671 LB T673, LV T673, LT T673, LW T673 LH T674 LS T676, LA T676, LO T676, LY T676, LB T676, LH T676, LSB T676, LW T676 LB T67C, LV T67C, LT T67C, LS T67K, LO T67K, LY T67K, LW E67C LS E67B, LA E67B, LO E67B, LY E67B, LB E67C, LV E67C, LT E67C LW T67C LS T679, LY T679, LG T679 LS T770, LO T770, LY T770, LG T770, LP T770 LB T773, LV T773, LT T773, LW T773 LH T774 LS E675, LA E675, LY E675, LS T675 LS T776, LA T776, LO T776, LY T776, LB T776 LHGB T686 LT T68C, LB T68C - Hyper Mini TOPLED® LB M676 - Mini TOPLED Santana® LG M470 LS M47K, LO M47K, LY M47K Source: http://www.osram.convergy.de LUXEON: - LUMILED® LXK2-PW12-R00, LXK2-PW12-S00, LXK2-PW14-U00, LXK2-PW14-V00 LXK2-PM12-R00, LXK2-PM12-S00, LXK2-PM14-U00 LXK2-PE12-Q00, LXK2-PE12-R00, LXK2-PE12-S00, LXK2-PE14-T00, LXK2-PE14-U00 LXK2-PB12-K00, LXK2-PB12-L00, LXK2-PB12-M00, LXK2-PB14-N00, LXK2-PB14-P00, LXK2-PB14-Q00 LXK2-PR12-L00, LXK2-PR12-M00, LXK2-PR14-Q00, LXK2-PR14-R00 LXK2-PD12-Q00, LXK2-PD12-R00, LXK2-PD12-S00 LXK2-PH12-R00, LXK2-PH12-S00 LXK2-PL12-P00, LXK2-PL12-Q00, LXK2-PL12-R00 Source: www.luxeon.com KINGBRIGHT: KA-3528ASYC Source: www.kingbright.com; MOUSER: 743-INL-3AB30
RN3 = resistor-sil:GE08R: SIL RESISTOR; MOUSER: 652-4609X-1LF-220; OC_FARNELL: unknown; OC_NEWARK: unknown

## Module ALU
Ports: A1(in) A2(in) A3(in) A4(in) A5(in) A6(in) A7(in) A8(in) B1(in) B2(in) B3(in) B4(in) B5(in) B6(in) B7(in) B8(in) D1(out) D2(out) D3(out) D4(out) D5(out) D6(out) D7(out) D8(out) !OUT(in) SU(in) CARRY(out) ZR(out) GND(pwr) VCC(pwr)
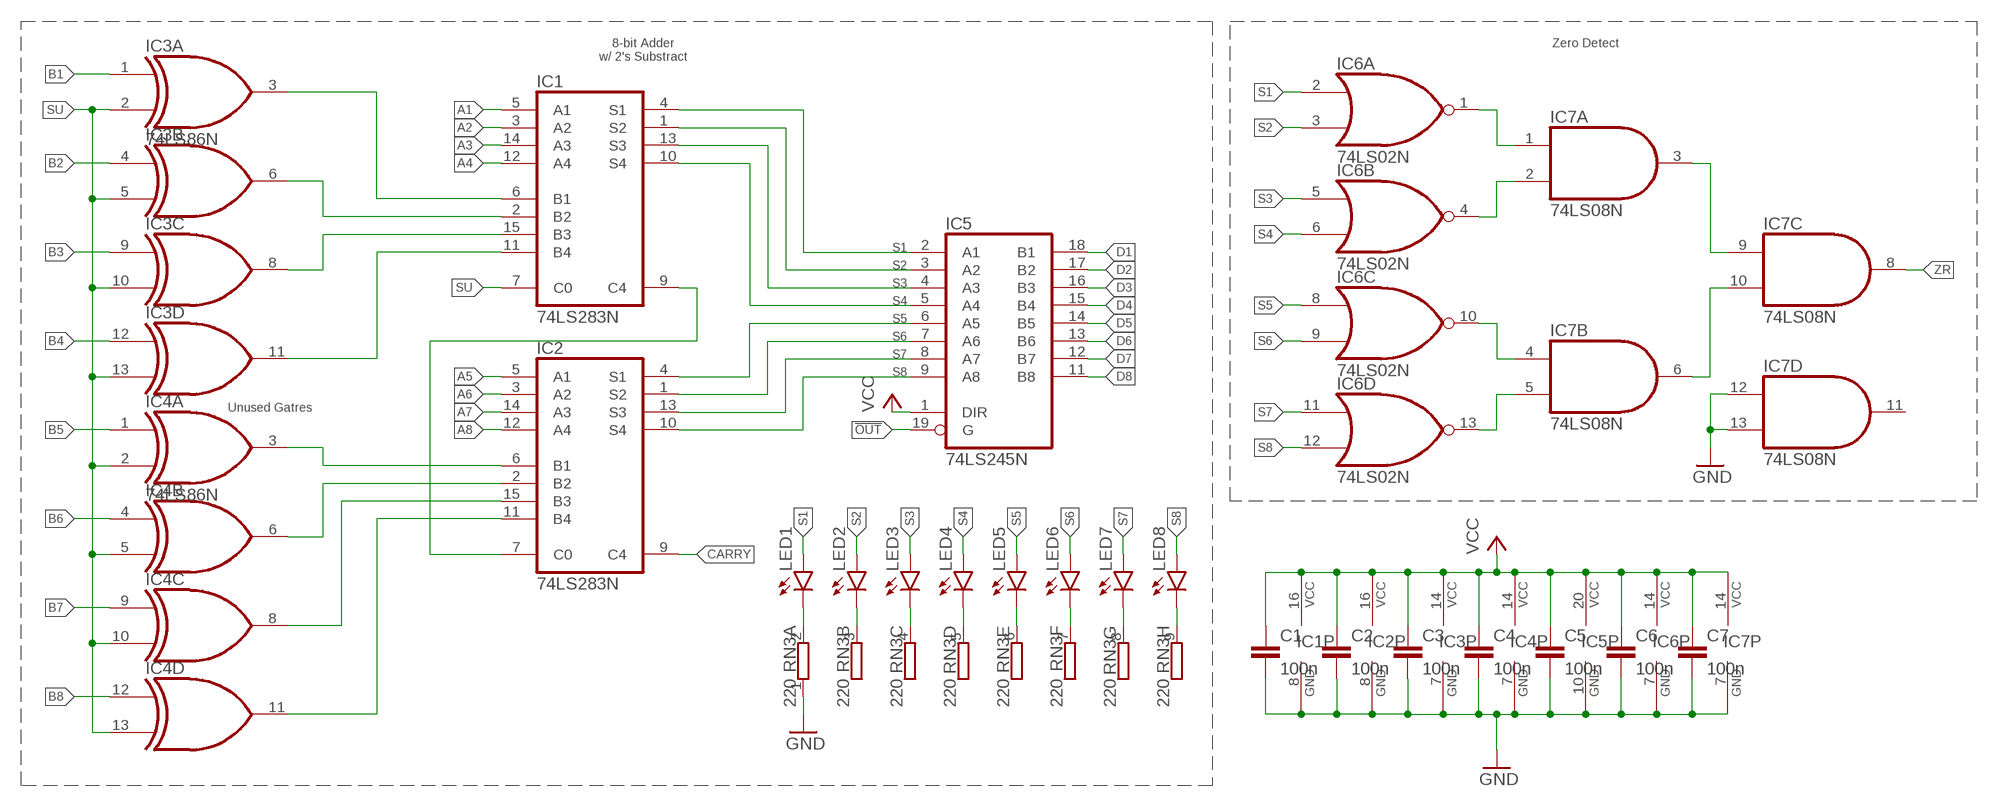
[diagram p4: schematic, module ALU, sheet 1]

### Parts
C1  100n  C-EU050-024X044  [C050-024X044]
C2  100n  C-EU050-024X044  [C050-024X044]
C3  100n  C-EU050-024X044  [C050-024X044]
C4  100n  C-EU050-024X044  [C050-024X044]
C5  100n  C-EU050-024X044  [C050-024X044]
C6  100n  C-EU050-024X044  [C050-024X044]
C7  100n  C-EU050-024X044  [C050-024X044]
IC1  74LS283N  [DIL16]
IC2  74LS283N  [DIL16]
IC3  74LS86N  [DIL14]
IC4  74LS86N  [DIL14]
IC5  74LS245N  [DIL20]
IC6  74LS02N  [DIL14]
IC7  74LS08N  74ALS08N  [DIL14]
LED1  RED  LED3MM  [LED3MM]
LED2  RED  LED3MM  [LED3MM]
LED3  RED  LED3MM  [LED3MM]
LED4  RED  LED3MM  [LED3MM]
LED5  RED  LED3MM  [LED3MM]
LED6  RED  LED3MM  [LED3MM]
LED7  RED  LED3MM  [LED3MM]
LED8  RED  LED3MM  [LED3MM]
RN3  220  GE08R  [SIL9]

### Nets
!OUT: IC5.19(G)
A1: IC1.5(A1)
A2: IC1.3(A2)
A3: IC1.14(A3)
A4: IC1.12(A4)
A5: IC2.5(A1)
A6: IC2.3(A2)
A7: IC2.14(A3)
A8: IC2.12(A4)
B1: IC3.1(A:I0)
B2: IC3.4(B:I0)
B3: IC3.9(C:I0)
B4: IC3.12(D:I0)
B5: IC4.1(A:I0)
B6: IC4.4(B:I0)
B7: IC4.9(C:I0)
B8: IC4.12(D:I0)
CARRY: IC2.9(C4)
D1: IC5.18(B1)
D2: IC5.17(B2)
D3: IC5.16(B3)
D4: IC5.15(B4)
D5: IC5.14(B5)
D6: IC5.13(B6)
D7: IC5.12(B7)
D8: IC5.11(B8)
GND: C1.2 C2.2 C3.2 C4.2 C5.2 C6.2 C7.2 IC1.8(GND) IC2.8(GND) IC3.7(P:GND) IC4.7(P:GND) IC5.10(GND) IC6.7(P:GND) IC7.7(P:GND) IC7.12(D:I0) IC7.13(D:I1) RN3.1
N$1: IC1.9(C4) IC2.7(C0)
N$2: IC6.1(A:O) IC7.1(A:I0)
N$3: IC6.4(B:O) IC7.2(A:I1)
N$4: IC6.10(C:O) IC7.4(B:I0)
N$5: IC6.13(D:O) IC7.5(B:I1)
N$6: IC7.3(A:O) IC7.9(C:I0)
N$7: IC7.6(B:O) IC7.10(C:I1)
N$8: LED8.K(C) RN3.9
N$9: LED7.K(C) RN3.8
N$10: LED6.K(C) RN3.7
N$11: LED5.K(C) RN3.6
N$12: LED4.K(C) RN3.5
N$13: LED3.K(C) RN3.4
N$14: LED2.K(C) RN3.3
N$15: LED1.K(C) RN3.2
N$18: IC1.6(B1) IC3.3(A:O)
N$19: IC1.2(B2) IC3.6(B:O)
N$20: IC1.15(B3) IC3.8(C:O)
N$21: IC1.11(B4) IC3.11(D:O)
N$22: IC2.6(B1) IC4.3(A:O)
N$23: IC2.2(B2) IC4.6(B:O)
N$24: IC2.15(B3) IC4.8(C:O)
N$25: IC2.11(B4) IC4.11(D:O)
S1: IC1.4(S1) IC5.2(A1) IC6.2(A:I0) LED1.A
S2: IC1.1(S2) IC5.3(A2) IC6.3(A:I1) LED2.A
S3: IC1.13(S3) IC5.4(A3) IC6.5(B:I0) LED3.A
S4: IC1.10(S4) IC5.5(A4) IC6.6(B:I1) LED4.A
S5: IC2.4(S1) IC5.6(A5) IC6.8(C:I0) LED5.A
S6: IC2.1(S2) IC5.7(A6) IC6.9(C:I1) LED6.A
S7: IC2.13(S3) IC5.8(A7) IC6.11(D:I0) LED7.A
S8: IC2.10(S4) IC5.9(A8) IC6.12(D:I1) LED8.A
SU: IC1.7(C0) IC3.2(A:I1) IC3.5(B:I1) IC3.10(C:I1) IC3.13(D:I1) IC4.2(A:I1) IC4.5(B:I1) IC4.10(C:I1) IC4.13(D:I1)
VCC: C1.1 C2.1 C3.1 C4.1 C5.1 C6.1 C7.1 IC1.16(VCC) IC2.16(VCC) IC3.14(P:VCC) IC4.14(P:VCC) IC5.1(DIR) IC5.20(VCC) IC6.14(P:VCC) IC7.14(P:VCC)
ZR: IC7.8(C:O)
Unconnected: IC7.11(D:O)

### Notes on the sheet
- 8-bit Adder
  w/ 2's Substract
- Zero Detect
- Unused Gatres

### Library data of the parts
C1-C7 = rcl:C-EU: CAPACITOR, European symbol; MOUSER: 594-K104K15X7RF53H5; SPICEPREFIX: C
IC1 IC2 = 74xx-us:74*283: 4-bit binary FULL ADDER, fast carry; MOUSER: 595-SN74LS283N
IC3 IC4 = 74xx-us:74*86: Quad 2-input EXCLUSIV-OR (XOR) gate; MOUSER: 595-SN74LS86AN
IC5 = 74xx-us:74*245: Octal BUS TRANSCEIVER, 3-state; MOUSER: 595-SN74LS245N
IC6 = 74xx-us:74*02: Quad 2-input NOR gate; MOUSER: 595-SN74LS02N
IC7 = 74xx-us:74*08: Quad 2-input AND gate; MOUSER: 595-SN74LS08N
LED1-LED8 = led:LED: LED OSRAM: - CHIPLED LG R971, LG N971, LY N971, LG Q971, LY Q971, LO R971, LY R971 LH N974, LH R974 LS Q976, LO Q976, LY Q976 LO Q996 - Hyper CHIPLED LW Q18S LB Q993, LB Q99A, LB R99A - SideLED LS A670, LO A670, LY A670, LG A670, LP A670 LB A673, LV A673, LT A673, LW A673 LH A674 LY A675 LS A676, LA A676, LO A676, LY A676, LW A676 LS A679, LY A679, LG A679 - Hyper Micro SIDELED® LS Y876, LA Y876, LO Y876, LY Y876 LT Y87S - SmartLED LW L88C, LW L88S LB L89C, LB L89S, LG L890 LS L89K, LO L89K, LY L89K LS L896, LA L896, LO L896, LY L896 - TOPLED LS T670, LO T670, LY T670, LG T670, LP T670 LSG T670, LSP T670, LSY T670, LOP T670, LYG T670 LG T671, LOG T671, LSG T671 LB T673, LV T673, LT T673, LW T673 LH T674 LS T676, LA T676, LO T676, LY T676, LB T676, LH T676, LSB T676, LW T676 LB T67C, LV T67C, LT T67C, LS T67K, LO T67K, LY T67K, LW E67C LS E67B, LA E67B, LO E67B, LY E67B, LB E67C, LV E67C, LT E67C LW T67C LS T679, LY T679, LG T679 LS T770, LO T770, LY T770, LG T770, LP T770 LB T773, LV T773, LT T773, LW T773 LH T774 LS E675, LA E675, LY E675, LS T675 LS T776, LA T776, LO T776, LY T776, LB T776 LHGB T686 LT T68C, LB T68C - Hyper Mini TOPLED® LB M676 - Mini TOPLED Santana® LG M470 LS M47K, LO M47K, LY M47K Source: http://www.osram.convergy.de LUXEON: - LUMILED® LXK2-PW12-R00, LXK2-PW12-S00, LXK2-PW14-U00, LXK2-PW14-V00 LXK2-PM12-R00, LXK2-PM12-S00, LXK2-PM14-U00 LXK2-PE12-Q00, LXK2-PE12-R00, LXK2-PE12-S00, LXK2-PE14-T00, LXK2-PE14-U00 LXK2-PB12-K00, LXK2-PB12-L00, LXK2-PB12-M00, LXK2-PB14-N00, LXK2-PB14-P00, LXK2-PB14-Q00 LXK2-PR12-L00, LXK2-PR12-M00, LXK2-PR14-Q00, LXK2-PR14-R00 LXK2-PD12-Q00, LXK2-PD12-R00, LXK2-PD12-S00 LXK2-PH12-R00, LXK2-PH12-S00 LXK2-PL12-P00, LXK2-PL12-Q00, LXK2-PL12-R00 Source: www.luxeon.com KINGBRIGHT: KA-3528ASYC Source: www.kingbright.com; MOUSER: 743-INL-3AR30
RN3 = resistor-sil:GE08R: SIL RESISTOR; MOUSER: 652-4609X-1LF-220; OC_FARNELL: unknown; OC_NEWARK: unknown

## Module DATA_REGISTER_B
Ports: D1(io) D2(io) D3(io) D4(io) D5(io) D6(io) D7(io) D8(io) B1(out) B2(out) B3(out) B4(out) B5(out) B6(out) B7(out) B8(out) CLK_IN(in) !OUT(in) !LOAD(in) CLR(in) GND(pwr) VCC(pwr)
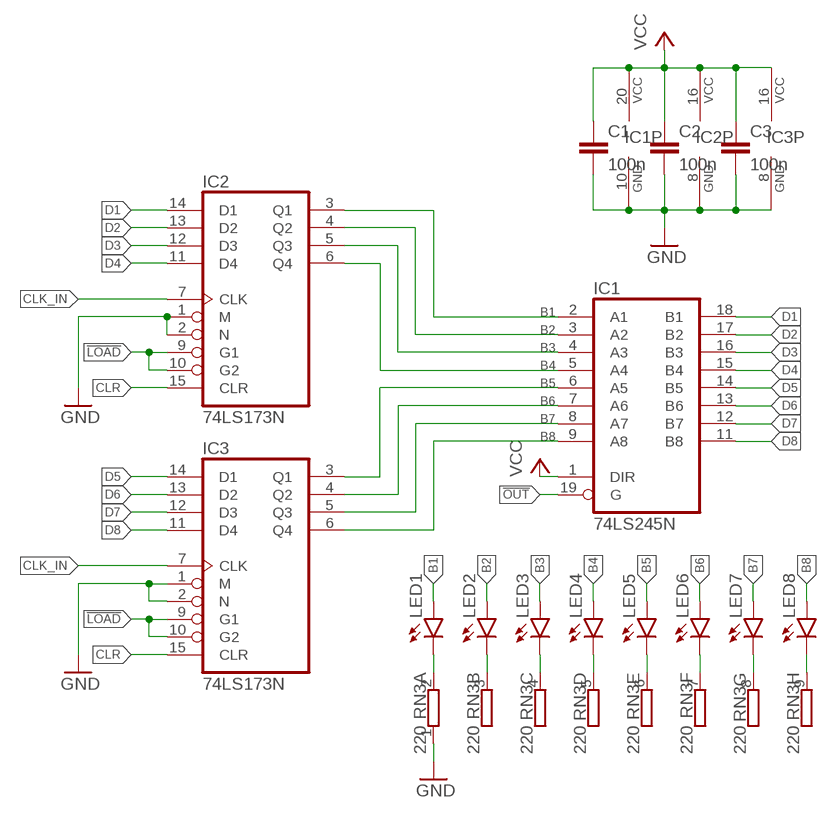
[diagram p5: schematic, module DATA_REGISTER_B, sheet 1]

### Parts
C1  100n  C-EU050-024X044  [C050-024X044]
C2  100n  C-EU050-024X044  [C050-024X044]
C3  100n  C-EU050-024X044  [C050-024X044]
IC1  74LS245N  [DIL20]
IC2  74LS173N  [DIL16]
IC3  74LS173N  [DIL16]
LED1  RED  LED3MM  [LED3MM]
LED2  RED  LED3MM  [LED3MM]
LED3  RED  LED3MM  [LED3MM]
LED4  RED  LED3MM  [LED3MM]
LED5  RED  LED3MM  [LED3MM]
LED6  RED  LED3MM  [LED3MM]
LED7  RED  LED3MM  [LED3MM]
LED8  RED  LED3MM  [LED3MM]
RN3  220  GE08R  [SIL9]

### Nets
!LOAD: IC2.9(G1) IC2.10(G2) IC3.9(G1) IC3.10(G2)
!OUT: IC1.19(G)
B1: IC1.2(A1) IC2.3(Q1) LED1.A
B2: IC1.3(A2) IC2.4(Q2) LED2.A
B3: IC1.4(A3) IC2.5(Q3) LED3.A
B4: IC1.5(A4) IC2.6(Q4) LED4.A
B5: IC1.6(A5) IC3.3(Q1) LED5.A
B6: IC1.7(A6) IC3.4(Q2) LED6.A
B7: IC1.8(A7) IC3.5(Q3) LED7.A
B8: IC1.9(A8) IC3.6(Q4) LED8.A
CLK_IN: IC2.7(CLK) IC3.7(CLK)
CLR: IC2.15(CLR) IC3.15(CLR)
D1: IC1.18(B1) IC2.14(D1)
D2: IC1.17(B2) IC2.13(D2)
D3: IC1.16(B3) IC2.12(D3)
D4: IC1.15(B4) IC2.11(D4)
D5: IC1.14(B5) IC3.14(D1)
D6: IC1.13(B6) IC3.13(D2)
D7: IC1.12(B7) IC3.12(D3)
D8: IC1.11(B8) IC3.11(D4)
GND: C1.2 C2.2 C3.2 IC1.10(GND) IC2.1(M) IC2.2(N) IC2.8(GND) IC3.1(M) IC3.2(N) IC3.8(GND) RN3.1
N$1: LED8.K(C) RN3.9
N$2: LED7.K(C) RN3.8
N$3: LED6.K(C) RN3.7
N$4: LED5.K(C) RN3.6
N$5: LED4.K(C) RN3.5
N$6: LED3.K(C) RN3.4
N$7: LED2.K(C) RN3.3
N$8: LED1.K(C) RN3.2
VCC: C1.1 C2.1 C3.1 IC1.1(DIR) IC1.20(VCC) IC2.16(VCC) IC3.16(VCC)

### Library data of the parts
C1-C3 = rcl:C-EU: CAPACITOR, European symbol; MOUSER: 594-K104K15X7RF53H5; SPICEPREFIX: C
IC1 = 74xx-us:74*245: Octal BUS TRANSCEIVER, 3-state; MOUSER: 595-SN74LS245N
IC2 IC3 = 74xx-us:74*173: 4-bit D type REGISTER, 3-state; MOUSER: SN74LS173AN
LED1-LED8 = led:LED: LED OSRAM: - CHIPLED LG R971, LG N971, LY N971, LG Q971, LY Q971, LO R971, LY R971 LH N974, LH R974 LS Q976, LO Q976, LY Q976 LO Q996 - Hyper CHIPLED LW Q18S LB Q993, LB Q99A, LB R99A - SideLED LS A670, LO A670, LY A670, LG A670, LP A670 LB A673, LV A673, LT A673, LW A673 LH A674 LY A675 LS A676, LA A676, LO A676, LY A676, LW A676 LS A679, LY A679, LG A679 - Hyper Micro SIDELED® LS Y876, LA Y876, LO Y876, LY Y876 LT Y87S - SmartLED LW L88C, LW L88S LB L89C, LB L89S, LG L890 LS L89K, LO L89K, LY L89K LS L896, LA L896, LO L896, LY L896 - TOPLED LS T670, LO T670, LY T670, LG T670, LP T670 LSG T670, LSP T670, LSY T670, LOP T670, LYG T670 LG T671, LOG T671, LSG T671 LB T673, LV T673, LT T673, LW T673 LH T674 LS T676, LA T676, LO T676, LY T676, LB T676, LH T676, LSB T676, LW T676 LB T67C, LV T67C, LT T67C, LS T67K, LO T67K, LY T67K, LW E67C LS E67B, LA E67B, LO E67B, LY E67B, LB E67C, LV E67C, LT E67C LW T67C LS T679, LY T679, LG T679 LS T770, LO T770, LY T770, LG T770, LP T770 LB T773, LV T773, LT T773, LW T773 LH T774 LS E675, LA E675, LY E675, LS T675 LS T776, LA T776, LO T776, LY T776, LB T776 LHGB T686 LT T68C, LB T68C - Hyper Mini TOPLED® LB M676 - Mini TOPLED Santana® LG M470 LS M47K, LO M47K, LY M47K Source: http://www.osram.convergy.de LUXEON: - LUMILED® LXK2-PW12-R00, LXK2-PW12-S00, LXK2-PW14-U00, LXK2-PW14-V00 LXK2-PM12-R00, LXK2-PM12-S00, LXK2-PM14-U00 LXK2-PE12-Q00, LXK2-PE12-R00, LXK2-PE12-S00, LXK2-PE14-T00, LXK2-PE14-U00 LXK2-PB12-K00, LXK2-PB12-L00, LXK2-PB12-M00, LXK2-PB14-N00, LXK2-PB14-P00, LXK2-PB14-Q00 LXK2-PR12-L00, LXK2-PR12-M00, LXK2-PR14-Q00, LXK2-PR14-R00 LXK2-PD12-Q00, LXK2-PD12-R00, LXK2-PD12-S00 LXK2-PH12-R00, LXK2-PH12-S00 LXK2-PL12-P00, LXK2-PL12-Q00, LXK2-PL12-R00 Source: www.luxeon.com KINGBRIGHT: KA-3528ASYC Source: www.kingbright.com; MOUSER: 743-INL-3AR30
RN3 = resistor-sil:GE08R: SIL RESISTOR; MOUSER: 652-4609X-1LF-220; OC_FARNELL: unknown; OC_NEWARK: unknown

## Module RAM
Ports: A1(io) A2(io) A3(io) A4(io) D1(io) D2(io) D3(io) D4(io) D5(io) D6(io) D7(io) D8(io) !OUT(in) P/R(io) LOAD(in) CLK_IN(in) VCC(pwr) GND(pwr)
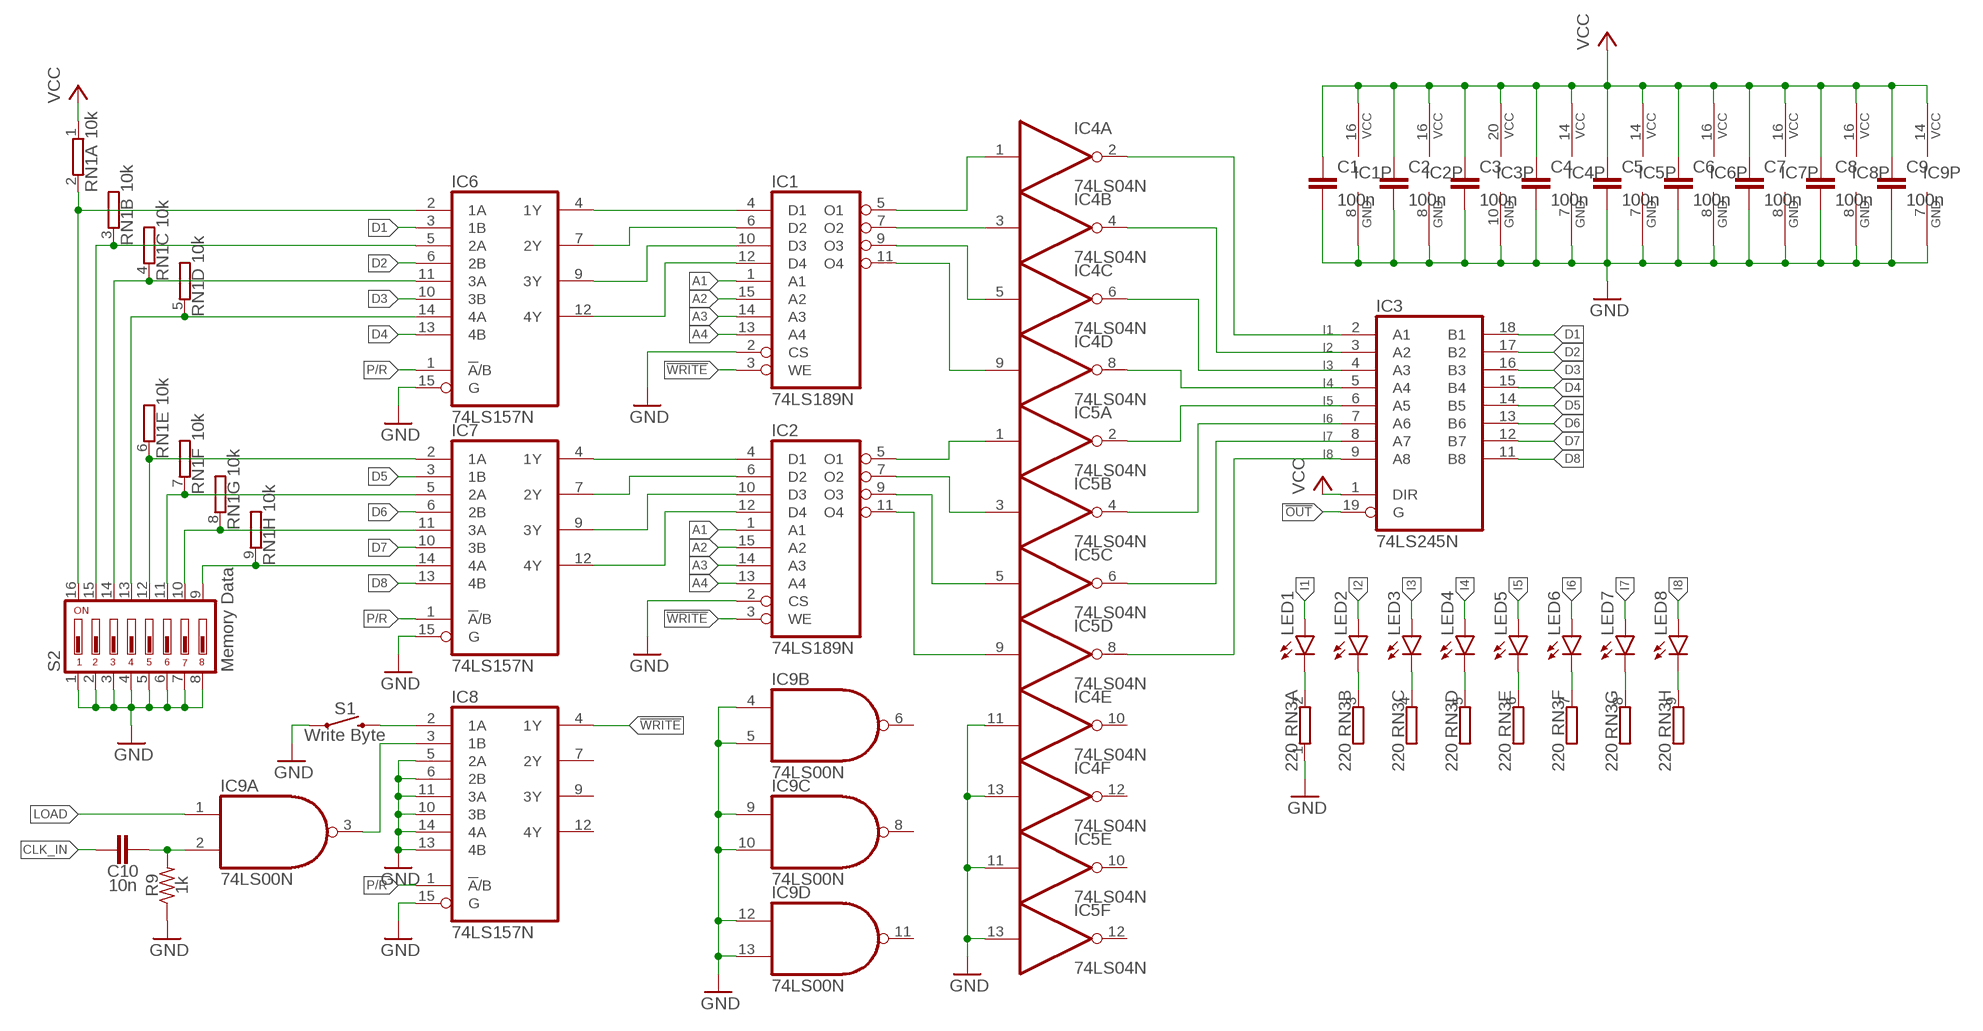
[diagram p6: schematic, module RAM, sheet 1]

### Parts
C1  100n  C-EU050-024X044  [C050-024X044]
C2  100n  C-EU050-024X044  [C050-024X044]
C3  100n  C-EU050-024X044  [C050-024X044]
C4  100n  C-EU050-024X044  [C050-024X044]
C5  100n  C-EU050-024X044  [C050-024X044]
C6  100n  C-EU050-024X044  [C050-024X044]
C7  100n  C-EU050-024X044  [C050-024X044]
C8  100n  C-EU050-024X044  [C050-024X044]
C9  100n  C-EU050-024X044  [C050-024X044]
C10  10n  C-EU050-024X044  [C050-024X044]
IC1  74LS189N  74LS189LSN  [DIL16]
IC2  74LS189N  74LS189LSN  [DIL16]
IC3  74LS245N  [DIL20]
IC4  74LS04N  [DIL14]
IC5  74LS04N  [DIL14]
IC6  74LS157N  [DIL16]
IC7  74LS157N  [DIL16]
IC8  74LS157N  [DIL16]
IC9  74LS00N  74ALS00N  [DIL14]
LED1  RED  LED3MM  [LED3MM]
LED2  RED  LED3MM  [LED3MM]
LED3  RED  LED3MM  [LED3MM]
LED4  RED  LED3MM  [LED3MM]
LED5  RED  LED3MM  [LED3MM]
LED6  RED  LED3MM  [LED3MM]
LED7  RED  LED3MM  [LED3MM]
LED8  RED  LED3MM  [LED3MM]
R9  1k  R-US_0204/7  [0204/7]
RN1  10k  GE08R  [SIL9]
RN3  220  GE08R  [SIL9]
S1  Write Byte  MOMENTARY-SWITCH-SPST-PTH-12MM  [TACTILE_SWITCH_PTH_12MM]
S2  Memory Data  DIP08YL  [DIP08YL]

### Nets
!OUT: IC3.19(G)
!WRITE: IC1.3(WE) IC2.3(WE) IC8.4(1Y)
A1: IC1.1(A1) IC2.1(A1)
A2: IC1.15(A2) IC2.15(A2)
A3: IC1.14(A3) IC2.14(A3)
A4: IC1.13(A4) IC2.13(A4)
B1: IC1.4(D1) IC6.4(1Y)
B2: IC1.6(D2) IC6.7(2Y)
B3: IC1.10(D3) IC6.9(3Y)
B4: IC1.12(D4) IC6.12(4Y)
B5: IC2.4(D1) IC7.4(1Y)
B6: IC2.6(D2) IC7.7(2Y)
B7: IC2.10(D3) IC7.9(3Y)
B8: IC2.12(D4) IC7.12(4Y)
CLK_IN: C10.1
D1: IC3.18(B1) IC6.3(1B)
D2: IC3.17(B2) IC6.6(2B)
D3: IC3.16(B3) IC6.10(3B)
D4: IC3.15(B4) IC6.13(4B)
D5: IC3.14(B5) IC7.3(1B)
D6: IC3.13(B6) IC7.6(2B)
D7: IC3.12(B7) IC7.10(3B)
D8: IC3.11(B8) IC7.13(4B)
GND: C1.2 C2.2 C3.2 C4.2 C5.2 C6.2 C7.2 C8.2 C9.2 IC1.2(CS) IC1.8(GND) IC2.2(CS) IC2.8(GND) IC3.10(GND) IC4.7(P:GND) IC4.11(E:I) IC4.13(F:I) IC5.7(P:GND) IC5.11(E:I) IC5.13(F:I) IC6.8(GND) IC6.15(G) IC7.8(GND) IC7.15(G) IC8.5(2A) IC8.6(2B) IC8.8(GND) IC8.10(3B) IC8.11(3A) IC8.13(4B) IC8.14(4A) IC8.15(G) IC9.4(B:I0) IC9.5(B:I1) IC9.7(P:GND) IC9.9(C:I0) IC9.10(C:I1) IC9.12(D:I0) IC9.13(D:I1) R9.1 RN3.1 S1.1 S2.1 S2.2 S2.3 S2.4 S2.5 S2.6 S2.7 S2.8
I1: IC3.2(A1) IC4.2(A:O) LED1.A
I2: IC3.3(A2) IC4.4(B:O) LED2.A
I3: IC3.4(A3) IC4.6(C:O) LED3.A
I4: IC3.5(A4) IC4.8(D:O) LED4.A
I5: IC3.6(A5) IC5.2(A:O) LED5.A
I6: IC3.7(A6) IC5.4(B:O) LED6.A
I7: IC3.8(A7) IC5.6(C:O) LED7.A
I8: IC3.9(A8) IC5.8(D:O) LED8.A
LOAD: IC9.1(A:I0)
N$1: IC1.5(O1) IC4.1(A:I)
N$2: IC1.7(O2) IC4.3(B:I)
N$3: IC1.9(O3) IC4.5(C:I)
N$4: IC1.11(O4) IC4.9(D:I)
N$5: IC2.5(O1) IC5.1(A:I)
N$6: IC2.7(O2) IC5.3(B:I)
N$7: IC2.9(O3) IC5.5(C:I)
N$8: IC2.11(O4) IC5.9(D:I)
N$9: LED8.K(C) RN3.9
N$10: LED7.K(C) RN3.8
N$11: LED6.K(C) RN3.7
N$12: LED5.K(C) RN3.6
N$13: LED4.K(C) RN3.5
N$14: LED3.K(C) RN3.4
N$15: LED2.K(C) RN3.3
N$16: LED1.K(C) RN3.2
N$17: IC8.2(1A) S1.3
N$18: IC7.14(4A) RN1.9 S2.9
N$19: IC7.11(3A) RN1.8 S2.10
N$20: IC7.5(2A) RN1.7 S2.11
N$21: IC7.2(1A) RN1.6 S2.12
N$22: IC6.14(4A) RN1.5 S2.13
N$23: IC6.11(3A) RN1.4 S2.14
N$24: IC6.5(2A) RN1.3 S2.15
N$25: IC6.2(1A) RN1.2 S2.16
N$26: IC8.3(1B) IC9.3(A:O)
N$27: C10.2 IC9.2(A:I1) R9.2
P/R: IC6.1(!A!/B) IC7.1(!A!/B) IC8.1(!A!/B)
VCC: C1.1 C2.1 C3.1 C4.1 C5.1 C6.1 C7.1 C8.1 C9.1 IC1.16(VCC) IC2.16(VCC) IC3.1(DIR) IC3.20(VCC) IC4.14(P:VCC) IC5.14(P:VCC) IC6.16(VCC) IC7.16(VCC) IC8.16(VCC) IC9.14(P:VCC) RN1.1
Unconnected: IC4.10(E:O) IC4.12(F:O) IC5.10(E:O) IC5.12(F:O) IC8.7(2Y) IC8.9(3Y) IC8.12(4Y) IC9.6(B:O) IC9.8(C:O) IC9.11(D:O)

### Library data of the parts
C1-C9 = rcl:C-EU: CAPACITOR, European symbol; MOUSER: 594-K104K15X7RF53H5; SPICEPREFIX: C
C10 = rcl:C-EU: CAPACITOR, European symbol; MOUSER: 594-K103K15X7RF5TH5; SPICEPREFIX: C
IC1 IC2 = SAP-1:74LS189: 64-Bit Random Access Memory with 3-STATE Outputs; EBAY: TRUE
IC3 = 74xx-us:74*245: Octal BUS TRANSCEIVER, 3-state; MOUSER: 595-SN74LS245N
IC4 IC5 = 74xx-us:74*04: Hex INVERTER; MOUSER: 595-SN74LS06N
IC6-IC8 = 74xx-us:74*157: Quadruple 2-line to 1-line data SELECTOR/MULTIPLEXER; MOUSER: 595-SN74LS157N
IC9 = 74xx-us:74*00: Quad 2-input NAND gate; MOUSER: 595-SN74LS00N
LED1-LED8 = led:LED: LED OSRAM: - CHIPLED LG R971, LG N971, LY N971, LG Q971, LY Q971, LO R971, LY R971 LH N974, LH R974 LS Q976, LO Q976, LY Q976 LO Q996 - Hyper CHIPLED LW Q18S LB Q993, LB Q99A, LB R99A - SideLED LS A670, LO A670, LY A670, LG A670, LP A670 LB A673, LV A673, LT A673, LW A673 LH A674 LY A675 LS A676, LA A676, LO A676, LY A676, LW A676 LS A679, LY A679, LG A679 - Hyper Micro SIDELED® LS Y876, LA Y876, LO Y876, LY Y876 LT Y87S - SmartLED LW L88C, LW L88S LB L89C, LB L89S, LG L890 LS L89K, LO L89K, LY L89K LS L896, LA L896, LO L896, LY L896 - TOPLED LS T670, LO T670, LY T670, LG T670, LP T670 LSG T670, LSP T670, LSY T670, LOP T670, LYG T670 LG T671, LOG T671, LSG T671 LB T673, LV T673, LT T673, LW T673 LH T674 LS T676, LA T676, LO T676, LY T676, LB T676, LH T676, LSB T676, LW T676 LB T67C, LV T67C, LT T67C, LS T67K, LO T67K, LY T67K, LW E67C LS E67B, LA E67B, LO E67B, LY E67B, LB E67C, LV E67C, LT E67C LW T67C LS T679, LY T679, LG T679 LS T770, LO T770, LY T770, LG T770, LP T770 LB T773, LV T773, LT T773, LW T773 LH T774 LS E675, LA E675, LY E675, LS T675 LS T776, LA T776, LO T776, LY T776, LB T776 LHGB T686 LT T68C, LB T68C - Hyper Mini TOPLED® LB M676 - Mini TOPLED Santana® LG M470 LS M47K, LO M47K, LY M47K Source: http://www.osram.convergy.de LUXEON: - LUMILED® LXK2-PW12-R00, LXK2-PW12-S00, LXK2-PW14-U00, LXK2-PW14-V00 LXK2-PM12-R00, LXK2-PM12-S00, LXK2-PM14-U00 LXK2-PE12-Q00, LXK2-PE12-R00, LXK2-PE12-S00, LXK2-PE14-T00, LXK2-PE14-U00 LXK2-PB12-K00, LXK2-PB12-L00, LXK2-PB12-M00, LXK2-PB14-N00, LXK2-PB14-P00, LXK2-PB14-Q00 LXK2-PR12-L00, LXK2-PR12-M00, LXK2-PR14-Q00, LXK2-PR14-R00 LXK2-PD12-Q00, LXK2-PD12-R00, LXK2-PD12-S00 LXK2-PH12-R00, LXK2-PH12-S00 LXK2-PL12-P00, LXK2-PL12-Q00, LXK2-PL12-R00 Source: www.luxeon.com KINGBRIGHT: KA-3528ASYC Source: www.kingbright.com; MOUSER: 743-INL-3AR30
R9 = rcl:R-US_: RESISTOR, American symbol; MOUSER: 594-5063JD1K000F; SPICEPREFIX: R
RN1 = resistor-sil:GE08R: SIL RESISTOR; MOUSER: 652-4609X-1LF-10K; OC_FARNELL: unknown; OC_NEWARK: unknown
RN3 = resistor-sil:GE08R: SIL RESISTOR; MOUSER: 652-4609X-1LF-220; OC_FARNELL: unknown; OC_NEWARK: unknown
S1 = SparkFun-Switches:MOMENTARY-SWITCH-SPST: Momentary Switch (Pushbutton) - SPST Normally-open (NO) SPST momentary switches (buttons, pushbuttons). Variants PTH-12MM - 12mm square, through-hole Momentary Pushbutton Switch - 12mm Square <https://www.sparkfun.com/products/9190> (COM-09190) PTH-6.0MM, PTH-6.0MM-KIT - 6.0mm square, through-hole Mini Pushbutton Switch <https://www.sparkfun.com/products/97> (COM-00097) KIT package intended for soldering kit's - only one side of pads' copper is exposed. PTH-RIGHT-ANGLE-KIT - Right-angle, through-hole Right Angle Tactile Button <https://www.sparkfun.com/products/10791> - Used on SparkFun BigTime Watch Kit <https://www.sparkfun.com/products/11734> SMD-12MM - 12mm square, surface-mount Tactile Button - SMD (12mm) <https://www.sparkfun.com/products/12993> (COM-12993) Used on SparkFun PicoBoard <https://www.sparkfun.com/products/11888> SMD-4.5MM - 4.5mm Square Trackball Switch Used on SparkFun Blackberry Trackballer Breakout <https://www.sparkfun.com/products/13169> SMD-4.6MMX2.8MM - 4.60mm x 2.80mm, surface mount Used on SparkFun SAMD21 Mini Breakout <https://www.sparkfun.com/products/13664> SMD-5.2MM, SMD-5.2-REDUNDANT - 5.2mm square, surface-mount Mini Pushbutton Switch - SMD <https://www.sparkfun.com/products/8720> (COM-08720) Used on Arduino Pro Mini <https://www.sparkfun.com/products/11114> REDUNDANT package connects both switch circuits together SMD-6.0X3.5MM - 6.0 x 3.5mm, surface mount Momentary Reset Switch SMD <https://www.sparkfun.com/products/8229> (COM-08229) SMD-6.2MM-TALL - 6.2mm square, surface mount Tactile Button - SMD (6mm) <https://www.sparkfun.com/products/12992> Used on SparkFun Digital Sandbox <https://www.sparkfun.com/products/12651> SMD-RIGHT-ANGLE - Right-angle, surface mount Used on SparkFun Block for Intel® Edison - Arduino <https://www.sparkfun.com/products/13036>; MOUSER: 474-COM-09190; PROD_ID: SWCH-09185; SF_SKU: COM-09190
S2 = switch-dil:DIP08YL: DIL/CODE SWITCH; MOUSER: 611-BDB08; OC_FARNELL: unknown; OC_NEWARK: unknown

## Module MEMORY_ADDRESS_REGISTER
Ports: A1(io) A2(io) A3(io) A4(io) !LOAD(in) CLR(in) CLK_IN(in) D1(io) D2(io) D3(io) D4(io) P/R(io) VCC(pwr) GND(pwr)
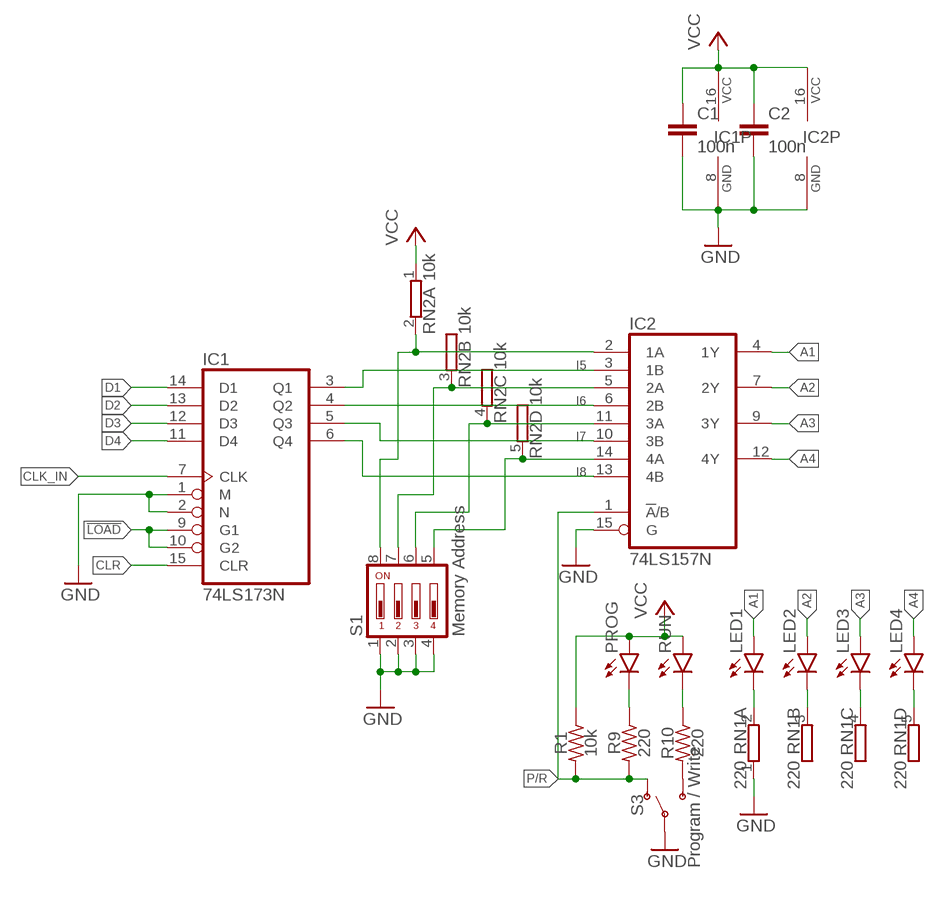
[diagram p7: schematic, module MEMORY_ADDRESS_REGISTER, sheet 1]

### Parts
C1  100n  C-EU050-024X044  [C050-024X044]
C2  100n  C-EU050-024X044  [C050-024X044]
IC1  74LS173N  [DIL16]
IC2  74LS157N  [DIL16]
LED1  BLUE  LED3MM  [LED3MM]
LED2  BLUE  LED3MM  [LED3MM]
LED3  BLUE  LED3MM  [LED3MM]
LED4  BLUE  LED3MM  [LED3MM]
PROG  RED  LED3MM  [LED3MM]
R1  10k  R-US_0204/7  [0204/7]
R9  220  R-US_0204/7  [0204/7]
R10  220  R-US_0204/7  [0204/7]
RN1  220  GE04R  [SIL5]
RN2  10k  GE04R  [SIL5]
RUN  GREEN  LED3MM  [LED3MM]
S1  Memory Address  DIP04YL  [DIP04YL]
S3  Program / Write  SWITCH-SPDT-PTH-11.6X4.0MM-KIT  [SWITCH_SPDT_PTH_11.6X4.0MM_KIT]

### Nets
!LOAD: IC1.9(G1) IC1.10(G2)
A1: IC2.4(1Y) LED1.A
A2: IC2.7(2Y) LED2.A
A3: IC2.9(3Y) LED3.A
A4: IC2.12(4Y) LED4.A
CLK_IN: IC1.7(CLK)
CLR: IC1.15(CLR)
D1: IC1.14(D1)
D2: IC1.13(D2)
D3: IC1.12(D3)
D4: IC1.11(D4)
GND: C1.2 C2.2 IC1.1(M) IC1.2(N) IC1.8(GND) IC2.8(GND) IC2.15(G) RN1.1 S1.1 S1.2 S1.3 S1.4 S3.2(P)
I5: IC1.3(Q1) IC2.3(1B)
I6: IC1.4(Q2) IC2.6(2B)
I7: IC1.5(Q3) IC2.10(3B)
I8: IC1.6(Q4) IC2.13(4B)
N$1: IC2.2(1A) RN2.2 S1.8
N$2: LED4.K(C) RN1.5
N$3: IC2.5(2A) RN2.3 S1.7
N$4: LED3.K(C) RN1.4
N$5: IC2.11(3A) RN2.4 S1.6
N$7: R10.2 S3.3(S)
N$8: LED2.K(C) RN1.3
N$9: PROG.K(C) R9.1
N$10: LED1.K(C) RN1.2
N$11: IC2.14(4A) RN2.5 S1.5
N$13: R10.1 RUN.K(C)
P/R: IC2.1(!A!/B) R1.2 R9.2 S3.1(O)
VCC: C1.1 C2.1 IC1.16(VCC) IC2.16(VCC) PROG.A R1.1 RN2.1 RUN.A

### Library data of the parts
C1 C2 = rcl:C-EU: CAPACITOR, European symbol; MOUSER: 594-K104K15X7RF53H5; SPICEPREFIX: C
IC1 = 74xx-us:74*173: 4-bit D type REGISTER, 3-state; MOUSER: SN74LS173AN
IC2 = 74xx-us:74*157: Quadruple 2-line to 1-line data SELECTOR/MULTIPLEXER; MOUSER: 595-SN74LS157N
LED1-LED4 = led:LED: LED OSRAM: - CHIPLED LG R971, LG N971, LY N971, LG Q971, LY Q971, LO R971, LY R971 LH N974, LH R974 LS Q976, LO Q976, LY Q976 LO Q996 - Hyper CHIPLED LW Q18S LB Q993, LB Q99A, LB R99A - SideLED LS A670, LO A670, LY A670, LG A670, LP A670 LB A673, LV A673, LT A673, LW A673 LH A674 LY A675 LS A676, LA A676, LO A676, LY A676, LW A676 LS A679, LY A679, LG A679 - Hyper Micro SIDELED® LS Y876, LA Y876, LO Y876, LY Y876 LT Y87S - SmartLED LW L88C, LW L88S LB L89C, LB L89S, LG L890 LS L89K, LO L89K, LY L89K LS L896, LA L896, LO L896, LY L896 - TOPLED LS T670, LO T670, LY T670, LG T670, LP T670 LSG T670, LSP T670, LSY T670, LOP T670, LYG T670 LG T671, LOG T671, LSG T671 LB T673, LV T673, LT T673, LW T673 LH T674 LS T676, LA T676, LO T676, LY T676, LB T676, LH T676, LSB T676, LW T676 LB T67C, LV T67C, LT T67C, LS T67K, LO T67K, LY T67K, LW E67C LS E67B, LA E67B, LO E67B, LY E67B, LB E67C, LV E67C, LT E67C LW T67C LS T679, LY T679, LG T679 LS T770, LO T770, LY T770, LG T770, LP T770 LB T773, LV T773, LT T773, LW T773 LH T774 LS E675, LA E675, LY E675, LS T675 LS T776, LA T776, LO T776, LY T776, LB T776 LHGB T686 LT T68C, LB T68C - Hyper Mini TOPLED® LB M676 - Mini TOPLED Santana® LG M470 LS M47K, LO M47K, LY M47K Source: http://www.osram.convergy.de LUXEON: - LUMILED® LXK2-PW12-R00, LXK2-PW12-S00, LXK2-PW14-U00, LXK2-PW14-V00 LXK2-PM12-R00, LXK2-PM12-S00, LXK2-PM14-U00 LXK2-PE12-Q00, LXK2-PE12-R00, LXK2-PE12-S00, LXK2-PE14-T00, LXK2-PE14-U00 LXK2-PB12-K00, LXK2-PB12-L00, LXK2-PB12-M00, LXK2-PB14-N00, LXK2-PB14-P00, LXK2-PB14-Q00 LXK2-PR12-L00, LXK2-PR12-M00, LXK2-PR14-Q00, LXK2-PR14-R00 LXK2-PD12-Q00, LXK2-PD12-R00, LXK2-PD12-S00 LXK2-PH12-R00, LXK2-PH12-S00 LXK2-PL12-P00, LXK2-PL12-Q00, LXK2-PL12-R00 Source: www.luxeon.com KINGBRIGHT: KA-3528ASYC Source: www.kingbright.com; MOUSER: 743-INL-3AB30
PROG = led:LED: LED OSRAM: - CHIPLED LG R971, LG N971, LY N971, LG Q971, LY Q971, LO R971, LY R971 LH N974, LH R974 LS Q976, LO Q976, LY Q976 LO Q996 - Hyper CHIPLED LW Q18S LB Q993, LB Q99A, LB R99A - SideLED LS A670, LO A670, LY A670, LG A670, LP A670 LB A673, LV A673, LT A673, LW A673 LH A674 LY A675 LS A676, LA A676, LO A676, LY A676, LW A676 LS A679, LY A679, LG A679 - Hyper Micro SIDELED® LS Y876, LA Y876, LO Y876, LY Y876 LT Y87S - SmartLED LW L88C, LW L88S LB L89C, LB L89S, LG L890 LS L89K, LO L89K, LY L89K LS L896, LA L896, LO L896, LY L896 - TOPLED LS T670, LO T670, LY T670, LG T670, LP T670 LSG T670, LSP T670, LSY T670, LOP T670, LYG T670 LG T671, LOG T671, LSG T671 LB T673, LV T673, LT T673, LW T673 LH T674 LS T676, LA T676, LO T676, LY T676, LB T676, LH T676, LSB T676, LW T676 LB T67C, LV T67C, LT T67C, LS T67K, LO T67K, LY T67K, LW E67C LS E67B, LA E67B, LO E67B, LY E67B, LB E67C, LV E67C, LT E67C LW T67C LS T679, LY T679, LG T679 LS T770, LO T770, LY T770, LG T770, LP T770 LB T773, LV T773, LT T773, LW T773 LH T774 LS E675, LA E675, LY E675, LS T675 LS T776, LA T776, LO T776, LY T776, LB T776 LHGB T686 LT T68C, LB T68C - Hyper Mini TOPLED® LB M676 - Mini TOPLED Santana® LG M470 LS M47K, LO M47K, LY M47K Source: http://www.osram.convergy.de LUXEON: - LUMILED® LXK2-PW12-R00, LXK2-PW12-S00, LXK2-PW14-U00, LXK2-PW14-V00 LXK2-PM12-R00, LXK2-PM12-S00, LXK2-PM14-U00 LXK2-PE12-Q00, LXK2-PE12-R00, LXK2-PE12-S00, LXK2-PE14-T00, LXK2-PE14-U00 LXK2-PB12-K00, LXK2-PB12-L00, LXK2-PB12-M00, LXK2-PB14-N00, LXK2-PB14-P00, LXK2-PB14-Q00 LXK2-PR12-L00, LXK2-PR12-M00, LXK2-PR14-Q00, LXK2-PR14-R00 LXK2-PD12-Q00, LXK2-PD12-R00, LXK2-PD12-S00 LXK2-PH12-R00, LXK2-PH12-S00 LXK2-PL12-P00, LXK2-PL12-Q00, LXK2-PL12-R00 Source: www.luxeon.com KINGBRIGHT: KA-3528ASYC Source: www.kingbright.com; MOUSER: 743-INL-3AR30
R1 R9 R10 = rcl:R-US_: RESISTOR, American symbol; MOUSER: 594-5063JD220R0F; SPICEPREFIX: R
RN1 = resistor-sil:GE04R: SIL RESISTOR; MOUSER: 652-4605X-1LF-220; OC_FARNELL: unknown; OC_NEWARK: unknown
RN2 = resistor-sil:GE04R: SIL RESISTOR; MOUSER: 652-4605X-1LF-10K; OC_FARNELL: unknown; OC_NEWARK: unknown
RUN = led:LED: LED OSRAM: - CHIPLED LG R971, LG N971, LY N971, LG Q971, LY Q971, LO R971, LY R971 LH N974, LH R974 LS Q976, LO Q976, LY Q976 LO Q996 - Hyper CHIPLED LW Q18S LB Q993, LB Q99A, LB R99A - SideLED LS A670, LO A670, LY A670, LG A670, LP A670 LB A673, LV A673, LT A673, LW A673 LH A674 LY A675 LS A676, LA A676, LO A676, LY A676, LW A676 LS A679, LY A679, LG A679 - Hyper Micro SIDELED® LS Y876, LA Y876, LO Y876, LY Y876 LT Y87S - SmartLED LW L88C, LW L88S LB L89C, LB L89S, LG L890 LS L89K, LO L89K, LY L89K LS L896, LA L896, LO L896, LY L896 - TOPLED LS T670, LO T670, LY T670, LG T670, LP T670 LSG T670, LSP T670, LSY T670, LOP T670, LYG T670 LG T671, LOG T671, LSG T671 LB T673, LV T673, LT T673, LW T673 LH T674 LS T676, LA T676, LO T676, LY T676, LB T676, LH T676, LSB T676, LW T676 LB T67C, LV T67C, LT T67C, LS T67K, LO T67K, LY T67K, LW E67C LS E67B, LA E67B, LO E67B, LY E67B, LB E67C, LV E67C, LT E67C LW T67C LS T679, LY T679, LG T679 LS T770, LO T770, LY T770, LG T770, LP T770 LB T773, LV T773, LT T773, LW T773 LH T774 LS E675, LA E675, LY E675, LS T675 LS T776, LA T776, LO T776, LY T776, LB T776 LHGB T686 LT T68C, LB T68C - Hyper Mini TOPLED® LB M676 - Mini TOPLED Santana® LG M470 LS M47K, LO M47K, LY M47K Source: http://www.osram.convergy.de LUXEON: - LUMILED® LXK2-PW12-R00, LXK2-PW12-S00, LXK2-PW14-U00, LXK2-PW14-V00 LXK2-PM12-R00, LXK2-PM12-S00, LXK2-PM14-U00 LXK2-PE12-Q00, LXK2-PE12-R00, LXK2-PE12-S00, LXK2-PE14-T00, LXK2-PE14-U00 LXK2-PB12-K00, LXK2-PB12-L00, LXK2-PB12-M00, LXK2-PB14-N00, LXK2-PB14-P00, LXK2-PB14-Q00 LXK2-PR12-L00, LXK2-PR12-M00, LXK2-PR14-Q00, LXK2-PR14-R00 LXK2-PD12-Q00, LXK2-PD12-R00, LXK2-PD12-S00 LXK2-PH12-R00, LXK2-PH12-S00 LXK2-PL12-P00, LXK2-PL12-Q00, LXK2-PL12-R00 Source: www.luxeon.com KINGBRIGHT: KA-3528ASYC Source: www.kingbright.com; MOUSER: 859-LTL-4232N
S1 = switch-dil:DIP04YL: DIL/CODE SWITCH; MOUSER: 611-BDB04; OC_FARNELL: unknown; OC_NEWARK: unknown
S3 = SparkFun-Switches:SWITCH-SPDT: Single Pole, Double Throw (SPDT) Switch Single-pole, double-throw (SPDT) switch. Variant Overview SMD-AYZ0202 Surface Mount DPDT Switch <https://www.sparkfun.com/products/597> (COM-00597) Used on e.g. LilyPad Arduino USB - ATmega32U4 Board <https://www.sparkfun.com/products/12049> PTH-11.6X4.0MM SPDT Mini Power Switch <https://www.sparkfun.com/products/102> (COM-00102) Used on e.g. SparkFun Simon Says - Through-Hole Soldering Kit <https://www.sparkfun.com/products/10547> (KIT-10547) PTH-11.6X4.0MM-KIT KIT version of SPDT Mini Power Switch - Simplifies soldering by removing tStop of switch pins - only one side can be soldered. PTH-11.6X4.0MM-LOCK LOCK version of SPDT Mini Power Switch - Offset pins hold switch in place for easier soldering. SMD-RIGHT-ANGLE Surface Mount Right Angle Switch <https://www.sparkfun.com/products/10860> (COM-10860) Used on e.g. SparkFun ESP8266 Thing <https://www.sparkfun.com/products/13231>; MOUSER: 474-COM-00102; MOUSER_CHEAP: 474-COM-09609; PROD_ID: SWCH-08261; SF_SKU: COM-00102

## Module PROGRAM_COUNTER
Ports: D1(io) D2(io) D3(io) D4(io) CLK_IN(in) ENABLE(in) !LOAD(in) !OUT(in) !CLR(in) GND(pwr) VCC(pwr)
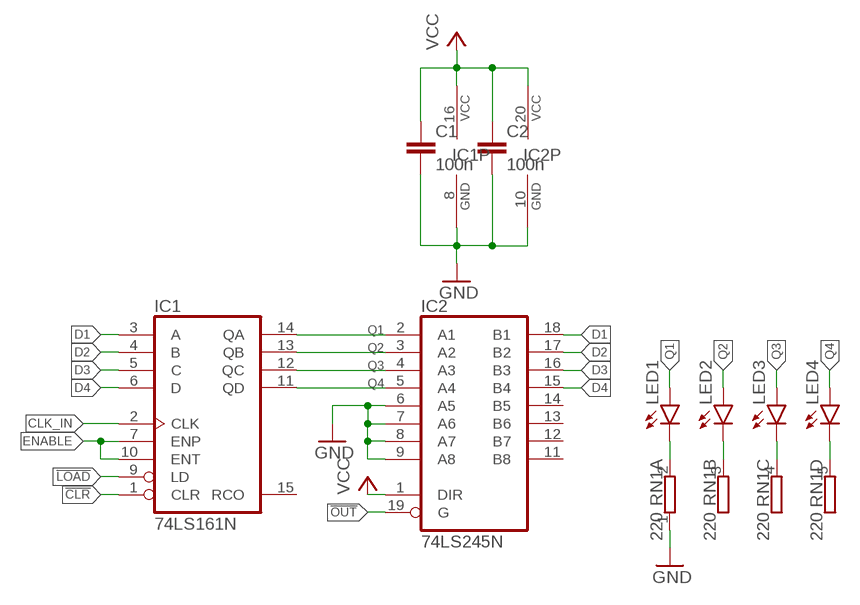
[diagram p8: schematic, module PROGRAM_COUNTER, sheet 1]

### Parts
C1  100n  C-EU050-024X044  [C050-024X044]
C2  100n  C-EU050-024X044  [C050-024X044]
IC1  74LS161N  74160N  [DIL16]
IC2  74LS245N  [DIL20]
LED1  BLUE  LED3MM  [LED3MM]
LED2  BLUE  LED3MM  [LED3MM]
LED3  BLUE  LED3MM  [LED3MM]
LED4  BLUE  LED3MM  [LED3MM]
RN1  220  GE04R  [SIL5]

### Nets
!CLR: IC1.1(CLR)
!LOAD: IC1.9(LD)
!OUT: IC2.19(G)
CLK_IN: IC1.2(CLK)
D1: IC1.3(A) IC2.18(B1)
D2: IC1.4(B) IC2.17(B2)
D3: IC1.5(C) IC2.16(B3)
D4: IC1.6(D) IC2.15(B4)
ENABLE: IC1.7(ENP) IC1.10(ENT)
GND: C1.2 C2.2 IC1.8(GND) IC2.6(A5) IC2.7(A6) IC2.8(A7) IC2.9(A8) IC2.10(GND) RN1.1
N$1: LED4.K(C) RN1.5
N$2: LED3.K(C) RN1.4
N$3: LED2.K(C) RN1.3
N$4: LED1.K(C) RN1.2
Q1: IC1.14(QA) IC2.2(A1) LED1.A
Q2: IC1.13(QB) IC2.3(A2) LED2.A
Q3: IC1.12(QC) IC2.4(A3) LED3.A
Q4: IC1.11(QD) IC2.5(A4) LED4.A
VCC: C1.1 C2.1 IC1.16(VCC) IC2.1(DIR) IC2.20(VCC)
Unconnected: IC1.15(RCO) IC2.11(B8) IC2.12(B7) IC2.13(B6) IC2.14(B5)

### Library data of the parts
C1 C2 = rcl:C-EU: CAPACITOR, European symbol; MOUSER: 594-K104K15X7RF53H5; SPICEPREFIX: C
IC1 = 74xx-us:74*160: Synchronous 4-bit COUNTER; MOUSER: 595-SN74LS161AN
IC2 = 74xx-us:74*245: Octal BUS TRANSCEIVER, 3-state; MOUSER: 595-SN74LS245N
LED1-LED4 = led:LED: LED OSRAM: - CHIPLED LG R971, LG N971, LY N971, LG Q971, LY Q971, LO R971, LY R971 LH N974, LH R974 LS Q976, LO Q976, LY Q976 LO Q996 - Hyper CHIPLED LW Q18S LB Q993, LB Q99A, LB R99A - SideLED LS A670, LO A670, LY A670, LG A670, LP A670 LB A673, LV A673, LT A673, LW A673 LH A674 LY A675 LS A676, LA A676, LO A676, LY A676, LW A676 LS A679, LY A679, LG A679 - Hyper Micro SIDELED® LS Y876, LA Y876, LO Y876, LY Y876 LT Y87S - SmartLED LW L88C, LW L88S LB L89C, LB L89S, LG L890 LS L89K, LO L89K, LY L89K LS L896, LA L896, LO L896, LY L896 - TOPLED LS T670, LO T670, LY T670, LG T670, LP T670 LSG T670, LSP T670, LSY T670, LOP T670, LYG T670 LG T671, LOG T671, LSG T671 LB T673, LV T673, LT T673, LW T673 LH T674 LS T676, LA T676, LO T676, LY T676, LB T676, LH T676, LSB T676, LW T676 LB T67C, LV T67C, LT T67C, LS T67K, LO T67K, LY T67K, LW E67C LS E67B, LA E67B, LO E67B, LY E67B, LB E67C, LV E67C, LT E67C LW T67C LS T679, LY T679, LG T679 LS T770, LO T770, LY T770, LG T770, LP T770 LB T773, LV T773, LT T773, LW T773 LH T774 LS E675, LA E675, LY E675, LS T675 LS T776, LA T776, LO T776, LY T776, LB T776 LHGB T686 LT T68C, LB T68C - Hyper Mini TOPLED® LB M676 - Mini TOPLED Santana® LG M470 LS M47K, LO M47K, LY M47K Source: http://www.osram.convergy.de LUXEON: - LUMILED® LXK2-PW12-R00, LXK2-PW12-S00, LXK2-PW14-U00, LXK2-PW14-V00 LXK2-PM12-R00, LXK2-PM12-S00, LXK2-PM14-U00 LXK2-PE12-Q00, LXK2-PE12-R00, LXK2-PE12-S00, LXK2-PE14-T00, LXK2-PE14-U00 LXK2-PB12-K00, LXK2-PB12-L00, LXK2-PB12-M00, LXK2-PB14-N00, LXK2-PB14-P00, LXK2-PB14-Q00 LXK2-PR12-L00, LXK2-PR12-M00, LXK2-PR14-Q00, LXK2-PR14-R00 LXK2-PD12-Q00, LXK2-PD12-R00, LXK2-PD12-S00 LXK2-PH12-R00, LXK2-PH12-S00 LXK2-PL12-P00, LXK2-PL12-Q00, LXK2-PL12-R00 Source: www.luxeon.com KINGBRIGHT: KA-3528ASYC Source: www.kingbright.com; MOUSER: 743-INL-3AB30
RN1 = resistor-sil:GE04R: SIL RESISTOR; MOUSER: 652-4605X-1LF-220; OC_FARNELL: unknown; OC_NEWARK: unknown

## Module OUTPUT_DISPLAY
Ports: CLK_IN(in) LOAD(in) !CLR(in) D1(in) D2(in) D3(in) D4(in) D5(in) D6(in) D7(in) D8(in) GND(pwr) VCC(pwr)
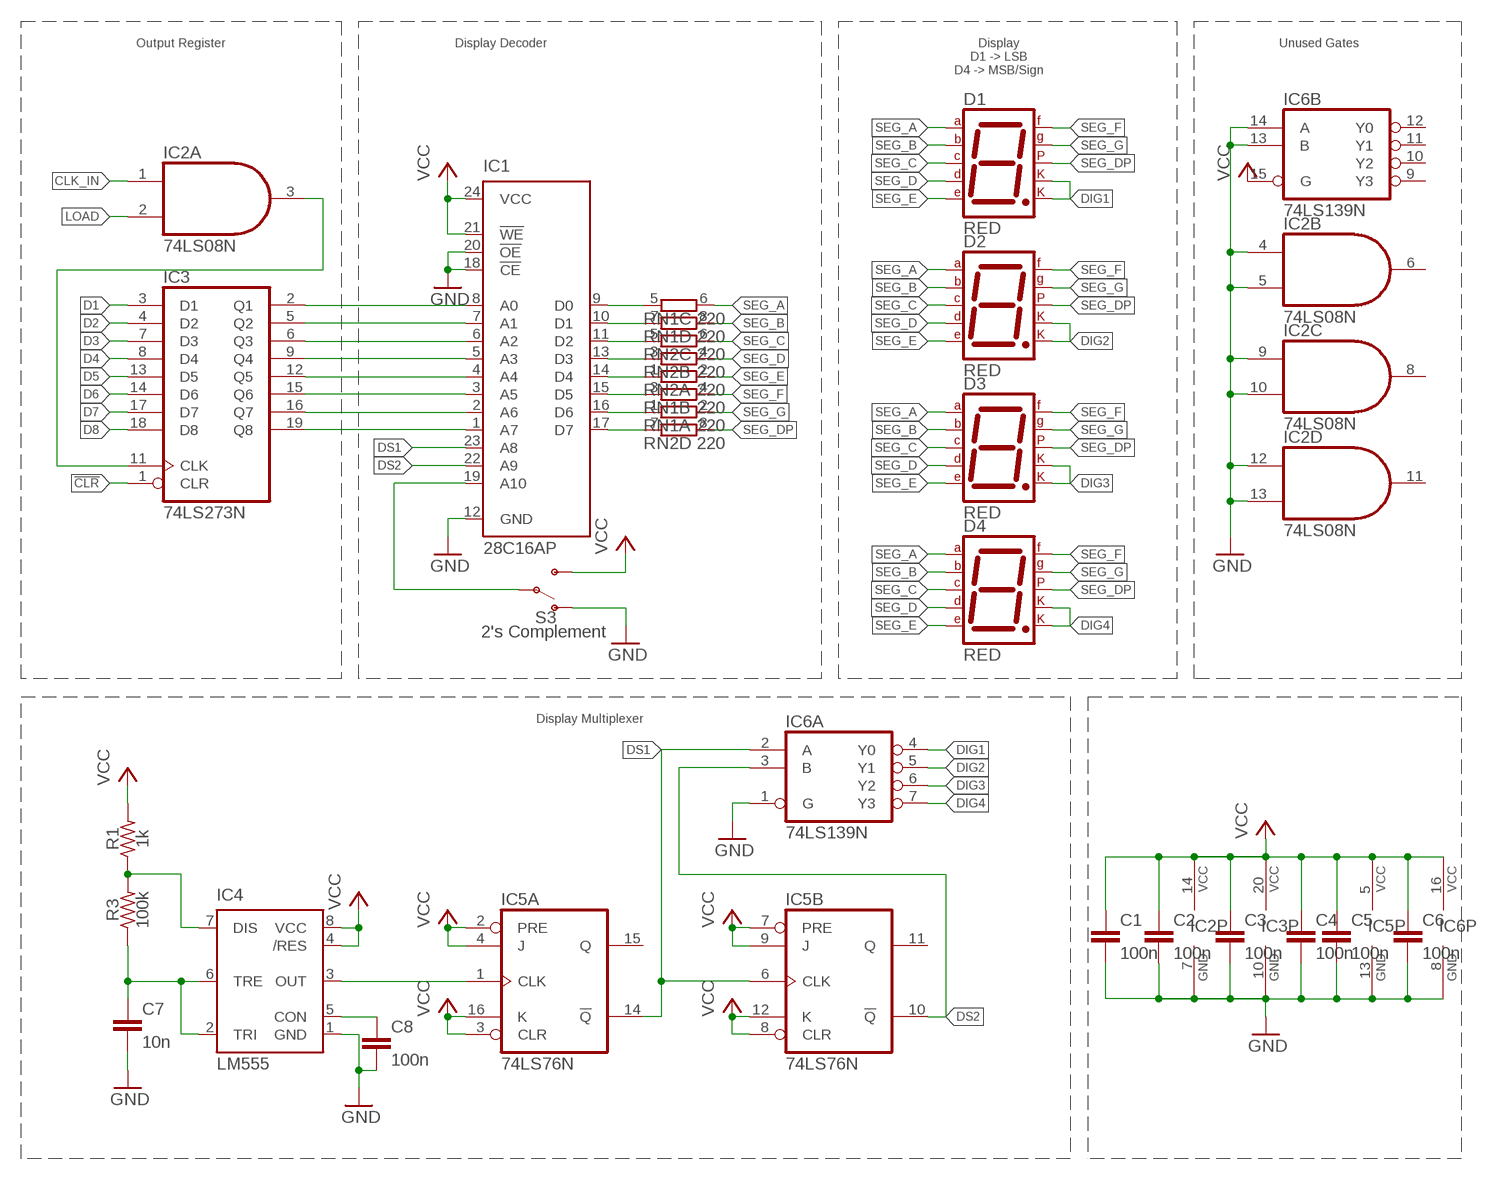
[diagram p9: schematic, module OUTPUT_DISPLAY, sheet 1]

### Parts
C1  100n  C-EU050-024X044  [C050-024X044]
C2  100n  C-EU050-024X044  [C050-024X044]
C3  100n  C-EU050-024X044  [C050-024X044]
C4  100n  C-EU050-024X044  [C050-024X044]
C5  100n  C-EU050-024X044  [C050-024X044]
C6  100n  C-EU050-024X044  [C050-024X044]
C7  10n  C-EU050-024X044  [C050-024X044]
C8  100n  C-EU050-024X044  [C050-024X044]
D1  RED  7SEG-CK  [7SEG-13]
D2  RED  7SEG-CK  [7SEG-13]
D3  RED  7SEG-CK  [7SEG-13]
D4  RED  7SEG-CK  [7SEG-13]
IC1  28C16AP  [DIL24-6]
IC2  74LS08N  74ALS08N  [DIL14]
IC3  74LS273N  74273N  [DIL20]
IC4  LM555  [DIP8]
IC5  74LS76N  7476N  [DIL16]
IC6  74LS139N  [DIL16]
R1  1k  R-US_0204/7  [0204/7]
R3  100k  R-US_0204/7  [0204/7]
RN1  220  E4R  [SIL8]
RN2  220  E4R  [SIL8]
S3  2's Complement  SWITCH-SPDT-PTH-11.6X4.0MM-KIT  [SWITCH_SPDT_PTH_11.6X4.0MM_KIT]

### Nets
2SC: IC1.19(A10) S3.2(P)
!CLR: IC3.1(CLR)
CLK_IN: IC2.1(A:I0)
D1: IC3.3(D1)
D2: IC3.4(D2)
D3: IC3.7(D3)
D4: IC3.8(D4)
D5: IC3.13(D5)
D6: IC3.14(D6)
D7: IC3.17(D7)
D8: IC3.18(D8)
DIG1: D1.3(CK1) D1.8(CK2) IC6.4(A:Y0)
DIG2: D2.3(CK1) D2.8(CK2) IC6.5(A:Y1)
DIG3: D3.3(CK1) D3.8(CK2) IC6.6(A:Y2)
DIG4: D4.3(CK1) D4.8(CK2) IC6.7(A:Y3)
DISP_CLK: IC4.3(OUT) IC5.1(A:CLK)
DS1: IC1.23(A8) IC5.6(B:CLK) IC5.14(A:!Q) IC6.2(A:A)
DS2: IC1.22(A9) IC5.10(B:!Q) IC6.3(A:B)
GND: C1.2 C2.2 C3.2 C4.2 C5.2 C6.2 C7.2 C8.2 IC1.12(GND) IC1.18(!CE) IC1.20(!OE) IC2.4(B:I0) IC2.5(B:I1) IC2.7(P:GND) IC2.9(C:I0) IC2.10(C:I1) IC2.12(D:I0) IC2.13(D:I1) IC3.10(GND) IC4.1(GND) IC5.13(P:GND) IC6.1(A:G) IC6.8(P:GND) IC6.13(B:B) IC6.14(B:A) S3.1(O)
LOAD: IC2.2(A:I1)
N$1: IC1.8(A0) IC3.2(Q1)
N$2: IC1.7(A1) IC3.5(Q2)
N$3: IC1.6(A2) IC3.6(Q3)
N$4: IC1.5(A3) IC3.9(Q4)
N$5: IC1.4(A4) IC3.12(Q5)
N$6: IC1.3(A5) IC3.15(Q6)
N$7: IC1.2(A6) IC3.16(Q7)
N$8: IC1.1(A7) IC3.19(Q8)
N$9: IC2.3(A:O) IC3.11(CLK)
N$10: C7.1 IC4.2(TRI) IC4.6(TRE) R3.1
N$13: IC4.7(DIS) R1.1 R3.2
N$15: C8.1 IC4.5(CON)
N$17: IC1.14(D4) RN2.1
SEG_A: D1.7(A) D2.7(A) D3.7(A) D4.7(A) RN1.6
SEG_AO: IC1.9(D0) RN1.5
SEG_B: D1.6(B) D2.6(B) D3.6(B) D4.6(B) RN1.8
SEG_BO: IC1.10(D1) RN1.7
SEG_C: D1.4(C) D2.4(C) D3.4(C) D4.4(C) RN2.6
SEG_CO: IC1.11(D2) RN2.5
SEG_D: D1.2(D) D2.2(D) D3.2(D) D4.2(D) RN2.4
SEG_DO: IC1.13(D3) RN2.3
SEG_DP: D1.5(DP) D2.5(DP) D3.5(DP) D4.5(DP) RN2.8
SEG_DPO: IC1.17(D7) RN2.7
SEG_E: D1.1(E) D2.1(E) D3.1(E) D4.1(E) RN2.2
SEG_F: D1.9(F) D2.9(F) D3.9(F) D4.9(F) RN1.4
SEG_FO: IC1.15(D5) RN1.3
SEG_G: D1.10(G) D2.10(G) D3.10(G) D4.10(G) RN1.2
SEG_GO: IC1.16(D6) RN1.1
VCC: C1.1 C2.1 C3.1 C4.1 C5.1 C6.1 IC1.21(!WE) IC1.24(VCC) IC2.14(P:VCC) IC3.20(VCC) IC4.4(/RES) IC4.8(VCC) IC5.2(A:PRE) IC5.3(A:CLR) IC5.4(A:J) IC5.5(P:VCC) IC5.7(B:PRE) IC5.8(B:CLR) IC5.9(B:J) IC5.12(B:K) IC5.16(A:K) IC6.15(B:G) IC6.16(P:VCC) R1.2 S3.3(S)
Unconnected: IC2.6(B:O) IC2.8(C:O) IC2.11(D:O) IC5.11(B:Q) IC5.15(A:Q) IC6.9(B:Y3) IC6.10(B:Y2) IC6.11(B:Y1) IC6.12(B:Y0)

### Notes on the sheet
- Output Register | Display Decoder
- Display
  D1 -> LSB
  D4 -> MSB/Sign
- Unused Gates
- Display Multiplexer

### Library data of the parts
C1-C6 C8 = rcl:C-EU: CAPACITOR, European symbol; MOUSER: 594-K104K15X7RF53H5; SPICEPREFIX: C
C7 = rcl:C-EU: CAPACITOR, European symbol; MOUSER: 594-K103K15X7RF5TH5; SPICEPREFIX: C
D1-D4 = special:7SEG-CK: 7-segment DISPLAY single cathode, 13 mm; MOUSER: 859-LTS-5003AWC
IC1 = microchip:28*16A: CMOS EPROM 16 K (2 K x 8) Source: ww1.microchip.com/downloads/en/DeviceDoc/11125J.pdf; EBAY: TRUE; MPN: CAT28C16ALI-12; OC_FARNELL: 1718292; OC_NEWARK: 06R0648
IC2 = 74xx-us:74*08: Quad 2-input AND gate; MOUSER: 595-SN74LS08N
IC3 = 74xx-us:74*273: Octal D type FLIP FLOP, clear; MOUSER: 595-SN74LS273N
IC4 = SAP-1:LM555; MOUSER: 926-LM555CN/NOPB
IC5 = 74xx-us:74*76: Dual J-K FLIP FLOP, preset and clear; EBAY: TRUE
IC6 = 74xx-us:74*139: Dual 2-line to 4-line DECODER/DEMULTIPLEXER; MOUSER: 595-SN74LS139AN
R1 = rcl:R-US_: RESISTOR, American symbol; MOUSER: 594-5063JD1K000F; SPICEPREFIX: R
R3 = rcl:R-US_: RESISTOR, American symbol; MOUSER: 594-5063JD100K0F; SPICEPREFIX: R
RN1 RN2 = resistor-sil:E4R: SIL RESISTOR; MOUSER: 652-4608X-2LF-220; OC_FARNELL: unknown; OC_NEWARK: unknown
S3 = SparkFun-Switches:SWITCH-SPDT: Single Pole, Double Throw (SPDT) Switch Single-pole, double-throw (SPDT) switch. Variant Overview SMD-AYZ0202 Surface Mount DPDT Switch <https://www.sparkfun.com/products/597> (COM-00597) Used on e.g. LilyPad Arduino USB - ATmega32U4 Board <https://www.sparkfun.com/products/12049> PTH-11.6X4.0MM SPDT Mini Power Switch <https://www.sparkfun.com/products/102> (COM-00102) Used on e.g. SparkFun Simon Says - Through-Hole Soldering Kit <https://www.sparkfun.com/products/10547> (KIT-10547) PTH-11.6X4.0MM-KIT KIT version of SPDT Mini Power Switch - Simplifies soldering by removing tStop of switch pins - only one side can be soldered. PTH-11.6X4.0MM-LOCK LOCK version of SPDT Mini Power Switch - Offset pins hold switch in place for easier soldering. SMD-RIGHT-ANGLE Surface Mount Right Angle Switch <https://www.sparkfun.com/products/10860> (COM-10860) Used on e.g. SparkFun ESP8266 Thing <https://www.sparkfun.com/products/13231>; MOUSER: 474-COM-00102; MOUSER_CHEAP: 474-COM-09609; PROD_ID: SWCH-08261; SF_SKU: COM-00102

## Module INSTRUCTION_DECODER
Ports: HLT(out) !MI(out) RI(out) !RO(out) !IO(out) !II(out) !AO(out) !AI(out) !EO(out) SU(out) !BI(out) OI(out) !CO(out) CE(out) !JP(out) CLR(out) !CLR(out) CLK_IN(in) I1(io) I2(io) I3(io) I4(io) !FI(out) CF(in) ZF(in) VCC(pwr) GND(pwr)
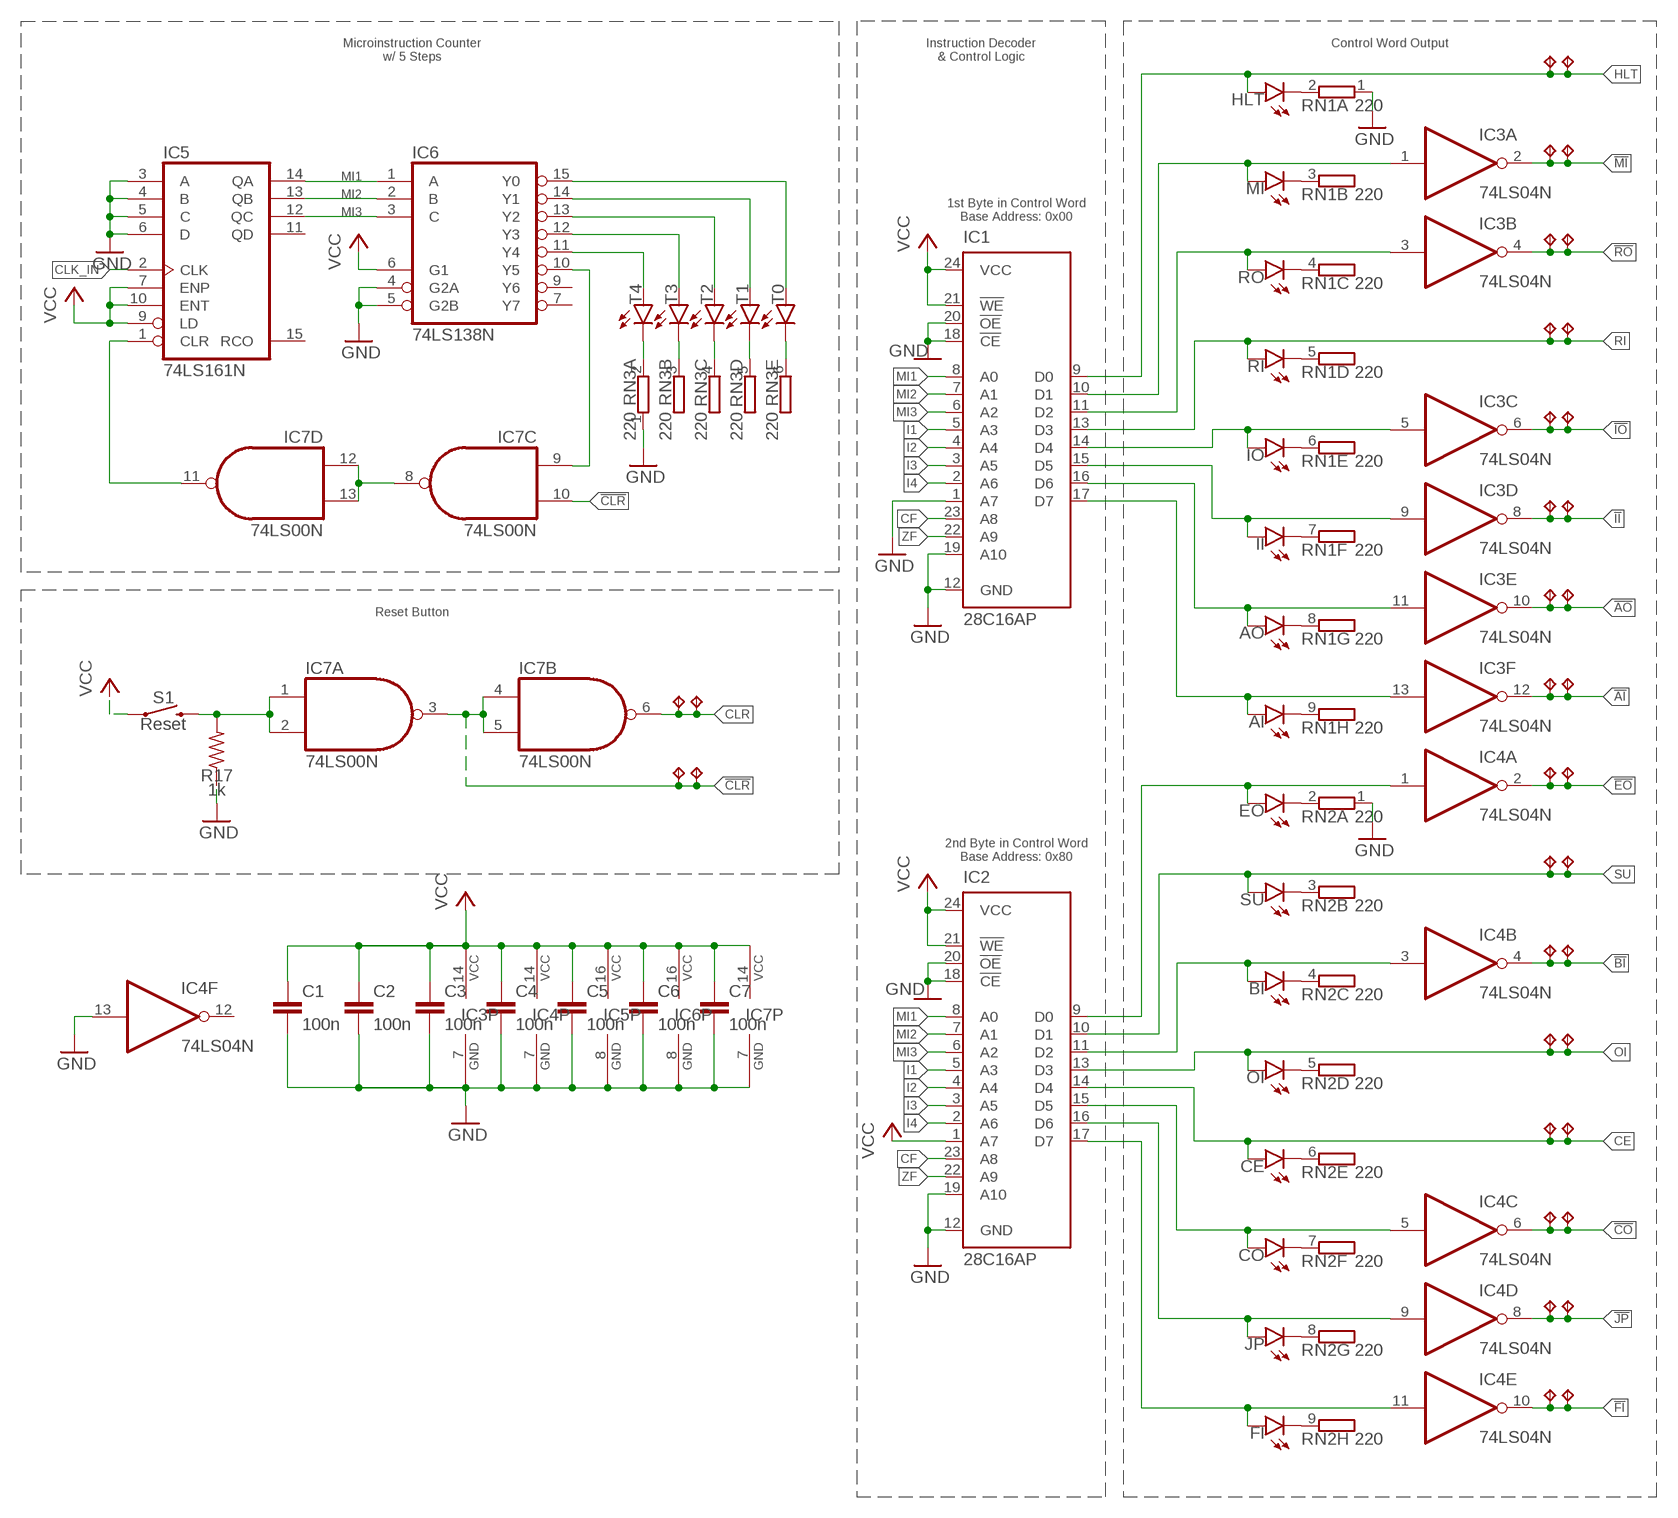
[diagram p10: schematic, module INSTRUCTION_DECODER, sheet 1]

### Parts
AI  RED  LED3MM  [LED3MM]
AO  RED  LED3MM  [LED3MM]
BI  RED  LED3MM  [LED3MM]
C1  100n  C-EU050-024X044  [C050-024X044]
C2  100n  C-EU050-024X044  [C050-024X044]
C3  100n  C-EU050-024X044  [C050-024X044]
C4  100n  C-EU050-024X044  [C050-024X044]
C5  100n  C-EU050-024X044  [C050-024X044]
C6  100n  C-EU050-024X044  [C050-024X044]
C7  100n  C-EU050-024X044  [C050-024X044]
CE  RED  LED3MM  [LED3MM]
CO  RED  LED3MM  [LED3MM]
EO  RED  LED3MM  [LED3MM]
FI  RED  LED3MM  [LED3MM]
HLT  RED  LED3MM  [LED3MM]
IC1  28C16AP  [DIL24-6]
IC2  28C16AP  [DIL24-6]
IC3  74LS04N  [DIL14]
IC4  74LS04N  [DIL14]
IC5  74LS161N  74160N  [DIL16]
IC6  74LS138N  [DIL16]
IC7  74LS00N  74ALS00N  [DIL14]
II  RED  LED3MM  [LED3MM]
IO  RED  LED3MM  [LED3MM]
JP  RED  LED3MM  [LED3MM]
MI  RED  LED3MM  [LED3MM]
OI  RED  LED3MM  [LED3MM]
R17  1k  R-US_0204/7  [0204/7]
RI  RED  LED3MM  [LED3MM]
RN1  220  GE08R  [SIL9]
RN2  220  GE08R  [SIL9]
RN3  220  GE08R  [SIL9]
RO  RED  LED3MM  [LED3MM]
S1  Reset  MOMENTARY-SWITCH-SPST-PTH-12MM  [TACTILE_SWITCH_PTH_12MM]
SU  RED  LED3MM  [LED3MM]
T0  GREEN  LED3MM  [LED3MM]
T1  GREEN  LED3MM  [LED3MM]
T2  GREEN  LED3MM  [LED3MM]
T3  GREEN  LED3MM  [LED3MM]
T4  GREEN  LED3MM  [LED3MM]
TP1  TPTP06R  [TP06R]
TP2  TPTP06R  [TP06R]
TP3  TPTP06R  [TP06R]
TP4  TPTP06R  [TP06R]
TP5  TPTP06R  [TP06R]
TP6  TPTP06R  [TP06R]
TP7  TPTP06R  [TP06R]
TP8  TPTP06R  [TP06R]
TP9  TPTP06R  [TP06R]
TP10  TPTP06R  [TP06R]
TP11  TPTP06R  [TP06R]
TP12  TPTP06R  [TP06R]
TP13  TPTP06R  [TP06R]
TP14  TPTP06R  [TP06R]
TP15  TPTP06R  [TP06R]
TP16  TPTP06R  [TP06R]
TP17  TPTP06R  [TP06R]
TP18  TPTP06R  [TP06R]
TP19  TPTP06R  [TP06R]
TP20  TPTP06R  [TP06R]
TP21  TPTP06R  [TP06R]
TP22  TPTP06R  [TP06R]
TP23  TPTP06R  [TP06R]
TP24  TPTP06R  [TP06R]
TP25  TPTP06R  [TP06R]
TP26  TPTP06R  [TP06R]
TP27  TPTP06R  [TP06R]
TP28  TPTP06R  [TP06R]
TP29  TPTP06R  [TP06R]
TP30  TPTP06R  [TP06R]
TP31  TPTP06R  [TP06R]
TP32  TPTP06R  [TP06R]
TP33  TPTP06R  [TP06R]
TP34  TPTP06R  [TP06R]
TP35  TPTP06R  [TP06R]
TP36  TPTP06R  [TP06R]

### Nets
!AI: IC3.12(F:O) TP8.TP TP26.TP
!AO: IC3.10(E:O) TP7.TP TP25.TP
!BI: IC4.4(B:O) TP11.TP TP29.TP
!CLR: IC7.3(A:O) IC7.4(B:I0) IC7.5(B:I1) IC7.10(C:I1) TP18.TP TP35.TP
!CO: IC4.6(C:O) TP14.TP TP32.TP
!EO: IC4.2(A:O) TP9.TP TP27.TP
!FI: IC4.10(E:O) TP16.TP TP34.TP
!II: IC3.8(D:O) TP6.TP TP24.TP
!IO: IC3.6(C:O) TP5.TP TP23.TP
!JP: IC4.8(D:O) TP15.TP TP33.TP
!MI: IC3.2(A:O) TP2.TP TP20.TP
!RO: IC3.4(B:O) TP3.TP TP21.TP
!T0: IC6.15(Y0) T0.A
!T1: IC6.14(Y1) T1.A
!T2: IC6.13(Y2) T2.A
!T3: IC6.12(Y3) T3.A
!T4: IC6.11(Y4) T4.A
AI: AI.A IC1.17(D7) IC3.13(F:I)
AO: AO.A IC1.16(D6) IC3.11(E:I)
BI: BI.A IC2.11(D2) IC4.3(B:I)
CE: CE.A IC2.14(D4) TP13.TP TP31.TP
CF: IC1.23(A8) IC2.23(A8)
CLK_IN: IC5.2(CLK)
CLR: IC7.6(B:O) TP17.TP TP36.TP
CO: CO.A IC2.15(D5) IC4.5(C:I)
EO: EO.A IC2.9(D0) IC4.1(A:I)
FI: FI.A IC2.17(D7) IC4.11(E:I)
GND: C1.2 C2.2 C3.2 C4.2 C5.2 C6.2 C7.2 IC1.1(A7) IC1.12(GND) IC1.18(!CE) IC1.19(A10) IC1.20(!OE) IC2.12(GND) IC2.18(!CE) IC2.19(A10) IC2.20(!OE) IC3.7(P:GND) IC4.7(P:GND) IC4.13(F:I) IC5.3(A) IC5.4(B) IC5.5(C) IC5.6(D) IC5.8(GND) IC6.4(G2A) IC6.5(G2B) IC6.8(GND) IC7.7(P:GND) R17.1 RN1.1 RN2.1 RN3.1
HLT: HLT.A IC1.9(D0) TP1.TP TP19.TP
I1: IC1.5(A3) IC2.5(A3)
I2: IC1.4(A4) IC2.4(A4)
I3: IC1.3(A5) IC2.3(A5)
I4: IC1.2(A6) IC2.2(A6)
II: IC1.15(D5) IC3.9(D:I) II.A
IO: IC1.14(D4) IC3.5(C:I) IO.A
JP: IC2.16(D6) IC4.9(D:I) JP.A
MI: IC1.10(D1) IC3.1(A:I) MI.A
MI1: IC1.8(A0) IC2.8(A0) IC5.14(QA) IC6.1(A)
MI2: IC1.7(A1) IC2.7(A1) IC5.13(QB) IC6.2(B)
MI3: IC1.6(A2) IC2.6(A2) IC5.12(QC) IC6.3(C)
N$1: HLT.K(C) RN1.2
N$2: MI.K(C) RN1.3
N$3: RN1.4 RO.K(C)
N$4: RI.K(C) RN1.5
N$5: IO.K(C) RN1.6
N$6: II.K(C) RN1.7
N$7: AO.K(C) RN1.8
N$8: AI.K(C) RN1.9
N$9: EO.K(C) RN2.2
N$10: RN2.3 SU.K(C)
N$11: BI.K(C) RN2.4
N$12: OI.K(C) RN2.5
N$13: CE.K(C) RN2.6
N$14: CO.K(C) RN2.7
N$15: JP.K(C) RN2.8
N$16: IC7.1(A:I0) IC7.2(A:I1) R17.2 S1.3
N$17: IC5.1(CLR) IC7.11(D:O)
N$18: IC7.8(C:O) IC7.12(D:I0) IC7.13(D:I1)
N$19: IC6.10(Y5) IC7.9(C:I0)
N$31: FI.K(C) RN2.9
N$33: RN3.4 T2.K(C)
N$34: RN3.2 T4.K(C)
N$35: RN3.3 T3.K(C)
N$36: RN3.5 T1.K(C)
N$37: RN3.6 T0.K(C)
OI: IC2.13(D3) OI.A TP12.TP TP30.TP
RI: IC1.13(D3) RI.A TP4.TP TP22.TP
RO: IC1.11(D2) IC3.3(B:I) RO.A
SU: IC2.10(D1) SU.A TP10.TP TP28.TP
VCC: C1.1 C2.1 C3.1 C4.1 C5.1 C6.1 C7.1 IC1.21(!WE) IC1.24(VCC) IC2.1(A7) IC2.21(!WE) IC2.24(VCC) IC3.14(P:VCC) IC4.14(P:VCC) IC5.7(ENP) IC5.9(LD) IC5.10(ENT) IC5.16(VCC) IC6.6(G1) IC6.16(VCC) IC7.14(P:VCC) S1.1
ZF: IC1.22(A9) IC2.22(A9)
Unconnected: IC4.12(F:O) IC5.11(QD) IC5.15(RCO) IC6.7(Y7) IC6.9(Y6) RN3.7 RN3.8 RN3.9

### Notes on the sheet
- Microinstruction Counter
  w/ 5 Steps
- Instruction Decoder
  & Control Logic
- Control Word Output
- 1st Byte in Control Word
  Base Address: 0x00
- Reset Button
- 2nd Byte in Control Word
  Base Address: 0x80

### Library data of the parts
AI AO BI CE CO EO FI HLT II IO JP MI OI RI RO SU = led:LED: LED OSRAM: - CHIPLED LG R971, LG N971, LY N971, LG Q971, LY Q971, LO R971, LY R971 LH N974, LH R974 LS Q976, LO Q976, LY Q976 LO Q996 - Hyper CHIPLED LW Q18S LB Q993, LB Q99A, LB R99A - SideLED LS A670, LO A670, LY A670, LG A670, LP A670 LB A673, LV A673, LT A673, LW A673 LH A674 LY A675 LS A676, LA A676, LO A676, LY A676, LW A676 LS A679, LY A679, LG A679 - Hyper Micro SIDELED® LS Y876, LA Y876, LO Y876, LY Y876 LT Y87S - SmartLED LW L88C, LW L88S LB L89C, LB L89S, LG L890 LS L89K, LO L89K, LY L89K LS L896, LA L896, LO L896, LY L896 - TOPLED LS T670, LO T670, LY T670, LG T670, LP T670 LSG T670, LSP T670, LSY T670, LOP T670, LYG T670 LG T671, LOG T671, LSG T671 LB T673, LV T673, LT T673, LW T673 LH T674 LS T676, LA T676, LO T676, LY T676, LB T676, LH T676, LSB T676, LW T676 LB T67C, LV T67C, LT T67C, LS T67K, LO T67K, LY T67K, LW E67C LS E67B, LA E67B, LO E67B, LY E67B, LB E67C, LV E67C, LT E67C LW T67C LS T679, LY T679, LG T679 LS T770, LO T770, LY T770, LG T770, LP T770 LB T773, LV T773, LT T773, LW T773 LH T774 LS E675, LA E675, LY E675, LS T675 LS T776, LA T776, LO T776, LY T776, LB T776 LHGB T686 LT T68C, LB T68C - Hyper Mini TOPLED® LB M676 - Mini TOPLED Santana® LG M470 LS M47K, LO M47K, LY M47K Source: http://www.osram.convergy.de LUXEON: - LUMILED® LXK2-PW12-R00, LXK2-PW12-S00, LXK2-PW14-U00, LXK2-PW14-V00 LXK2-PM12-R00, LXK2-PM12-S00, LXK2-PM14-U00 LXK2-PE12-Q00, LXK2-PE12-R00, LXK2-PE12-S00, LXK2-PE14-T00, LXK2-PE14-U00 LXK2-PB12-K00, LXK2-PB12-L00, LXK2-PB12-M00, LXK2-PB14-N00, LXK2-PB14-P00, LXK2-PB14-Q00 LXK2-PR12-L00, LXK2-PR12-M00, LXK2-PR14-Q00, LXK2-PR14-R00 LXK2-PD12-Q00, LXK2-PD12-R00, LXK2-PD12-S00 LXK2-PH12-R00, LXK2-PH12-S00 LXK2-PL12-P00, LXK2-PL12-Q00, LXK2-PL12-R00 Source: www.luxeon.com KINGBRIGHT: KA-3528ASYC Source: www.kingbright.com; MOUSER: 743-INL-3AR30
C1-C7 = rcl:C-EU: CAPACITOR, European symbol; MOUSER: 594-K104K15X7RF53H5; SPICEPREFIX: C
IC1 IC2 = microchip:28*16A: CMOS EPROM 16 K (2 K x 8) Source: ww1.microchip.com/downloads/en/DeviceDoc/11125J.pdf; EBAY: TRUE; MPN: CAT28C16ALI-12; OC_FARNELL: 1718292; OC_NEWARK: 06R0648
IC3 IC4 = 74xx-us:74*04: Hex INVERTER; MOUSER: 595-SN74LS06N
IC5 = 74xx-us:74*160: Synchronous 4-bit COUNTER; MOUSER: 595-SN74LS161AN
IC6 = 74xx-us:74*138: 3-line to 8-line DECODER/DEMULTIPLEXER; MOUSER: 595-SN74LS138N
IC7 = 74xx-us:74*00: Quad 2-input NAND gate; MOUSER: 595-SN74LS00N
R17 = rcl:R-US_: RESISTOR, American symbol; MOUSER: 594-5063JD1K000F; SPICEPREFIX: R
RN1-RN3 = resistor-sil:GE08R: SIL RESISTOR; MOUSER: 652-4609X-1LF-220; OC_FARNELL: unknown; OC_NEWARK: unknown
S1 = SparkFun-Switches:MOMENTARY-SWITCH-SPST: Momentary Switch (Pushbutton) - SPST Normally-open (NO) SPST momentary switches (buttons, pushbuttons). Variants PTH-12MM - 12mm square, through-hole Momentary Pushbutton Switch - 12mm Square <https://www.sparkfun.com/products/9190> (COM-09190) PTH-6.0MM, PTH-6.0MM-KIT - 6.0mm square, through-hole Mini Pushbutton Switch <https://www.sparkfun.com/products/97> (COM-00097) KIT package intended for soldering kit's - only one side of pads' copper is exposed. PTH-RIGHT-ANGLE-KIT - Right-angle, through-hole Right Angle Tactile Button <https://www.sparkfun.com/products/10791> - Used on SparkFun BigTime Watch Kit <https://www.sparkfun.com/products/11734> SMD-12MM - 12mm square, surface-mount Tactile Button - SMD (12mm) <https://www.sparkfun.com/products/12993> (COM-12993) Used on SparkFun PicoBoard <https://www.sparkfun.com/products/11888> SMD-4.5MM - 4.5mm Square Trackball Switch Used on SparkFun Blackberry Trackballer Breakout <https://www.sparkfun.com/products/13169> SMD-4.6MMX2.8MM - 4.60mm x 2.80mm, surface mount Used on SparkFun SAMD21 Mini Breakout <https://www.sparkfun.com/products/13664> SMD-5.2MM, SMD-5.2-REDUNDANT - 5.2mm square, surface-mount Mini Pushbutton Switch - SMD <https://www.sparkfun.com/products/8720> (COM-08720) Used on Arduino Pro Mini <https://www.sparkfun.com/products/11114> REDUNDANT package connects both switch circuits together SMD-6.0X3.5MM - 6.0 x 3.5mm, surface mount Momentary Reset Switch SMD <https://www.sparkfun.com/products/8229> (COM-08229) SMD-6.2MM-TALL - 6.2mm square, surface mount Tactile Button - SMD (6mm) <https://www.sparkfun.com/products/12992> Used on SparkFun Digital Sandbox <https://www.sparkfun.com/products/12651> SMD-RIGHT-ANGLE - Right-angle, surface mount Used on SparkFun Block for Intel® Edison - Arduino <https://www.sparkfun.com/products/13036>; MOUSER: 474-COM-09190; PROD_ID: SWCH-09185; SF_SKU: COM-09190
T0 T1-T4 = led:LED: LED OSRAM: - CHIPLED LG R971, LG N971, LY N971, LG Q971, LY Q971, LO R971, LY R971 LH N974, LH R974 LS Q976, LO Q976, LY Q976 LO Q996 - Hyper CHIPLED LW Q18S LB Q993, LB Q99A, LB R99A - SideLED LS A670, LO A670, LY A670, LG A670, LP A670 LB A673, LV A673, LT A673, LW A673 LH A674 LY A675 LS A676, LA A676, LO A676, LY A676, LW A676 LS A679, LY A679, LG A679 - Hyper Micro SIDELED® LS Y876, LA Y876, LO Y876, LY Y876 LT Y87S - SmartLED LW L88C, LW L88S LB L89C, LB L89S, LG L890 LS L89K, LO L89K, LY L89K LS L896, LA L896, LO L896, LY L896 - TOPLED LS T670, LO T670, LY T670, LG T670, LP T670 LSG T670, LSP T670, LSY T670, LOP T670, LYG T670 LG T671, LOG T671, LSG T671 LB T673, LV T673, LT T673, LW T673 LH T674 LS T676, LA T676, LO T676, LY T676, LB T676, LH T676, LSB T676, LW T676 LB T67C, LV T67C, LT T67C, LS T67K, LO T67K, LY T67K, LW E67C LS E67B, LA E67B, LO E67B, LY E67B, LB E67C, LV E67C, LT E67C LW T67C LS T679, LY T679, LG T679 LS T770, LO T770, LY T770, LG T770, LP T770 LB T773, LV T773, LT T773, LW T773 LH T774 LS E675, LA E675, LY E675, LS T675 LS T776, LA T776, LO T776, LY T776, LB T776 LHGB T686 LT T68C, LB T68C - Hyper Mini TOPLED® LB M676 - Mini TOPLED Santana® LG M470 LS M47K, LO M47K, LY M47K Source: http://www.osram.convergy.de LUXEON: - LUMILED® LXK2-PW12-R00, LXK2-PW12-S00, LXK2-PW14-U00, LXK2-PW14-V00 LXK2-PM12-R00, LXK2-PM12-S00, LXK2-PM14-U00 LXK2-PE12-Q00, LXK2-PE12-R00, LXK2-PE12-S00, LXK2-PE14-T00, LXK2-PE14-U00 LXK2-PB12-K00, LXK2-PB12-L00, LXK2-PB12-M00, LXK2-PB14-N00, LXK2-PB14-P00, LXK2-PB14-Q00 LXK2-PR12-L00, LXK2-PR12-M00, LXK2-PR14-Q00, LXK2-PR14-R00 LXK2-PD12-Q00, LXK2-PD12-R00, LXK2-PD12-S00 LXK2-PH12-R00, LXK2-PH12-S00 LXK2-PL12-P00, LXK2-PL12-Q00, LXK2-PL12-R00 Source: www.luxeon.com KINGBRIGHT: KA-3528ASYC Source: www.kingbright.com; MOUSER: 859-LTL-4232N
TP1-TP36 = testpad:TP: Test pad

## Module STATUS_REGISTER
Ports: !LOAD(in) CY(in) ZR(in) CF(out) ZF(out) CLR(in) CLK_IN(in) GND(pwr) VCC(pwr)
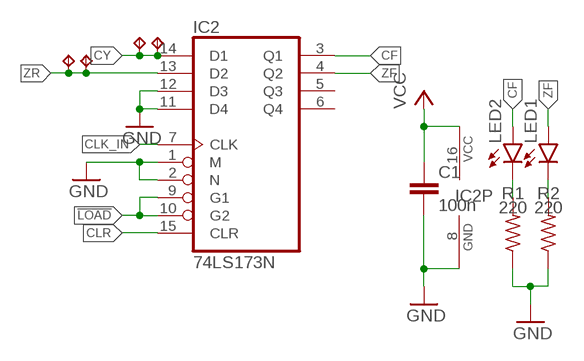
[diagram p11: schematic, module STATUS_REGISTER, sheet 1]

### Parts
C1  100n  C-EU050-024X044  [C050-024X044]
IC2  74LS173N  [DIL16]
LED1  BLUE  LED3MM  [LED3MM]
LED2  BLUE  LED3MM  [LED3MM]
R1  220  R-US_0204/7  [0204/7]
R2  220  R-US_0204/7  [0204/7]
TP1  TPTP06R  [TP06R]
TP2  TPTP06R  [TP06R]
TP3  TPTP06R  [TP06R]
TP4  TPTP06R  [TP06R]

### Nets
!LOAD: IC2.9(G1) IC2.10(G2)
CF: IC2.3(Q1) LED2.A
CLK_IN: IC2.7(CLK)
CLR: IC2.15(CLR)
CY: IC2.14(D1) TP1.TP TP4.TP
GND: C1.2 IC2.1(M) IC2.2(N) IC2.8(GND) IC2.11(D4) IC2.12(D3) R1.1 R2.1
N$1: LED1.K(C) R2.2
N$2: LED2.K(C) R1.2
VCC: C1.1 IC2.16(VCC)
ZF: IC2.4(Q2) LED1.A
ZR: IC2.13(D2) TP2.TP TP3.TP
Unconnected: IC2.5(Q3) IC2.6(Q4)

### Library data of the parts
C1 = rcl:C-EU: CAPACITOR, European symbol; MOUSER: 594-K104K15X7RF53H5; SPICEPREFIX: C
IC2 = 74xx-us:74*173: 4-bit D type REGISTER, 3-state; MOUSER: SN74LS173AN
LED1 LED2 = led:LED: LED OSRAM: - CHIPLED LG R971, LG N971, LY N971, LG Q971, LY Q971, LO R971, LY R971 LH N974, LH R974 LS Q976, LO Q976, LY Q976 LO Q996 - Hyper CHIPLED LW Q18S LB Q993, LB Q99A, LB R99A - SideLED LS A670, LO A670, LY A670, LG A670, LP A670 LB A673, LV A673, LT A673, LW A673 LH A674 LY A675 LS A676, LA A676, LO A676, LY A676, LW A676 LS A679, LY A679, LG A679 - Hyper Micro SIDELED® LS Y876, LA Y876, LO Y876, LY Y876 LT Y87S - SmartLED LW L88C, LW L88S LB L89C, LB L89S, LG L890 LS L89K, LO L89K, LY L89K LS L896, LA L896, LO L896, LY L896 - TOPLED LS T670, LO T670, LY T670, LG T670, LP T670 LSG T670, LSP T670, LSY T670, LOP T670, LYG T670 LG T671, LOG T671, LSG T671 LB T673, LV T673, LT T673, LW T673 LH T674 LS T676, LA T676, LO T676, LY T676, LB T676, LH T676, LSB T676, LW T676 LB T67C, LV T67C, LT T67C, LS T67K, LO T67K, LY T67K, LW E67C LS E67B, LA E67B, LO E67B, LY E67B, LB E67C, LV E67C, LT E67C LW T67C LS T679, LY T679, LG T679 LS T770, LO T770, LY T770, LG T770, LP T770 LB T773, LV T773, LT T773, LW T773 LH T774 LS E675, LA E675, LY E675, LS T675 LS T776, LA T776, LO T776, LY T776, LB T776 LHGB T686 LT T68C, LB T68C - Hyper Mini TOPLED® LB M676 - Mini TOPLED Santana® LG M470 LS M47K, LO M47K, LY M47K Source: http://www.osram.convergy.de LUXEON: - LUMILED® LXK2-PW12-R00, LXK2-PW12-S00, LXK2-PW14-U00, LXK2-PW14-V00 LXK2-PM12-R00, LXK2-PM12-S00, LXK2-PM14-U00 LXK2-PE12-Q00, LXK2-PE12-R00, LXK2-PE12-S00, LXK2-PE14-T00, LXK2-PE14-U00 LXK2-PB12-K00, LXK2-PB12-L00, LXK2-PB12-M00, LXK2-PB14-N00, LXK2-PB14-P00, LXK2-PB14-Q00 LXK2-PR12-L00, LXK2-PR12-M00, LXK2-PR14-Q00, LXK2-PR14-R00 LXK2-PD12-Q00, LXK2-PD12-R00, LXK2-PD12-S00 LXK2-PH12-R00, LXK2-PH12-S00 LXK2-PL12-P00, LXK2-PL12-Q00, LXK2-PL12-R00 Source: www.luxeon.com KINGBRIGHT: KA-3528ASYC Source: www.kingbright.com; MOUSER: 743-INL-3AB30
R1 R2 = rcl:R-US_: RESISTOR, American symbol; MOUSER: 594-5063JD220R0F; SPICEPREFIX: R
TP1-TP4 = testpad:TP: Test pad

## Net classes
1 pwr: width 0.254 mm
2 io: width 0.152 mm